# EasyEDA Pro project ELKS.eprj

# Schematic Schematic1

## Sheets
1 internal-logic: Create Date: 2023-01-13; Page Name: internal-logic; Project Name: ELKS; Schematic Name: Schematic1; Update Date: 2023-01-20; Company: EasyEDA.com; Drawed: EasyEDA Pro; Page Size: A4; Part Number: JLCPCB-002; Reviewed: EasyEDA Pro; Version: V0.1
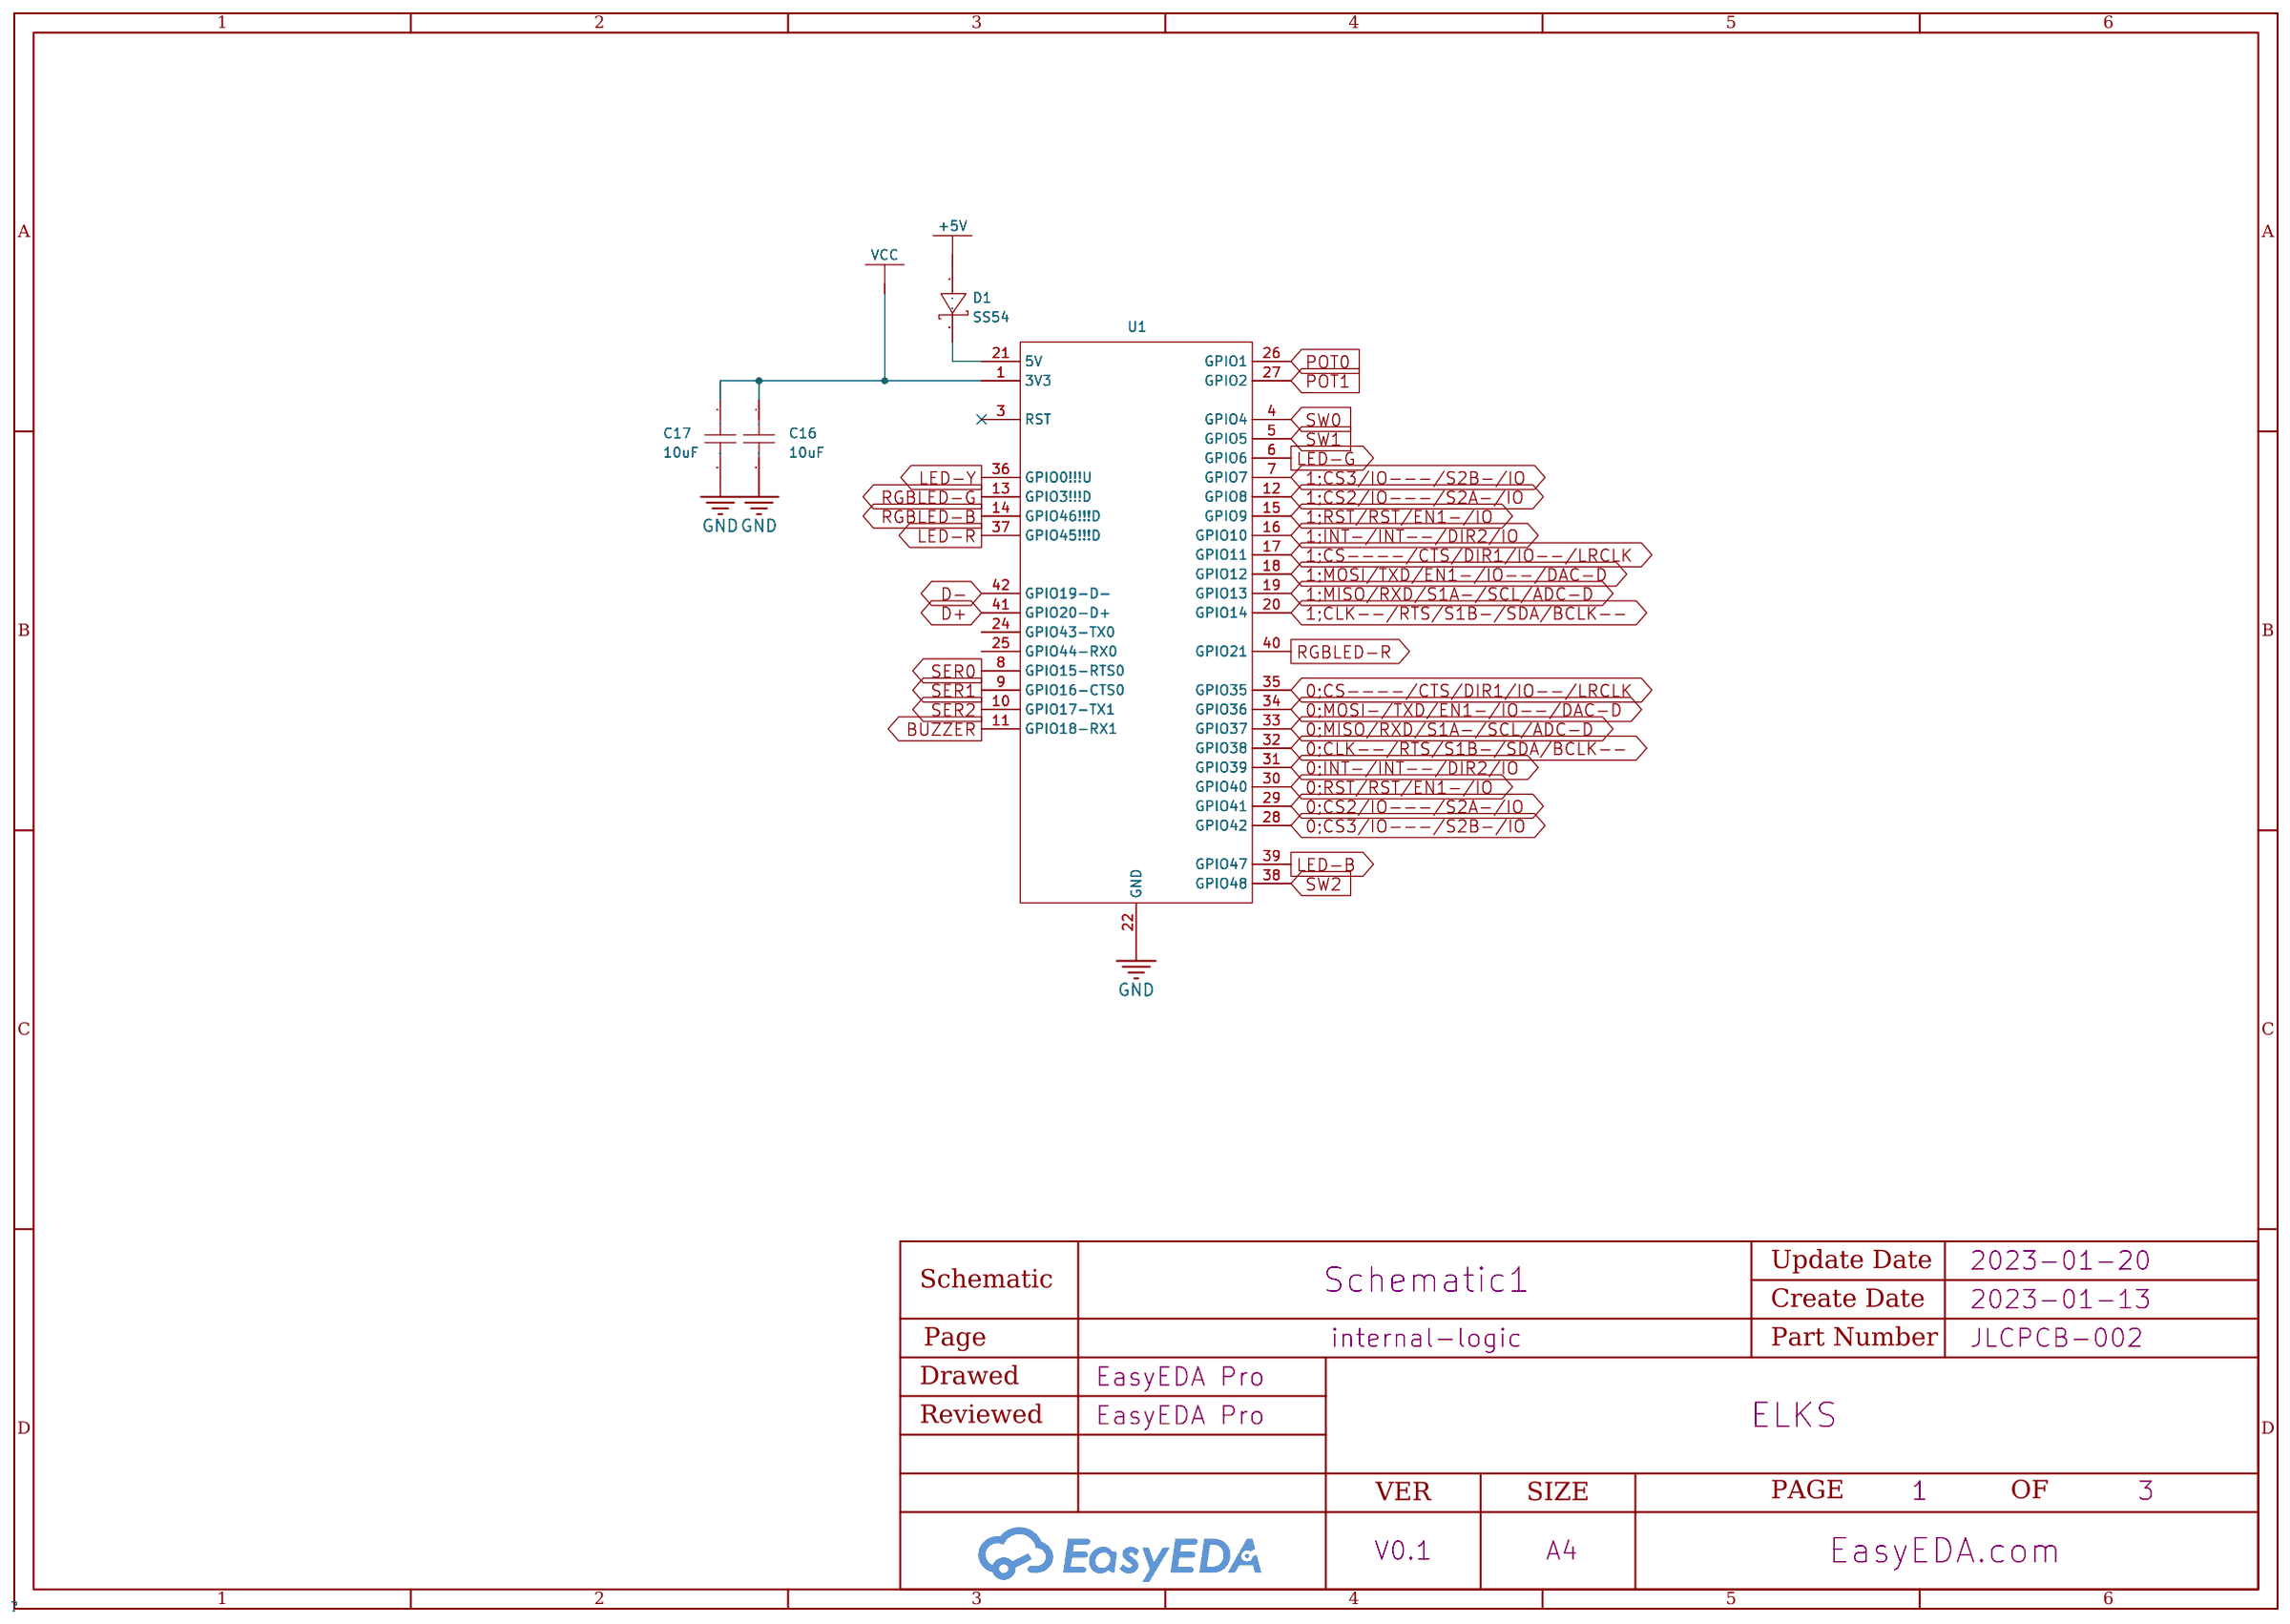
[diagram p0: internal-logic]
2 internal-peripheris: Create Date: 2023-01-14; Page Name: internal-peripheris
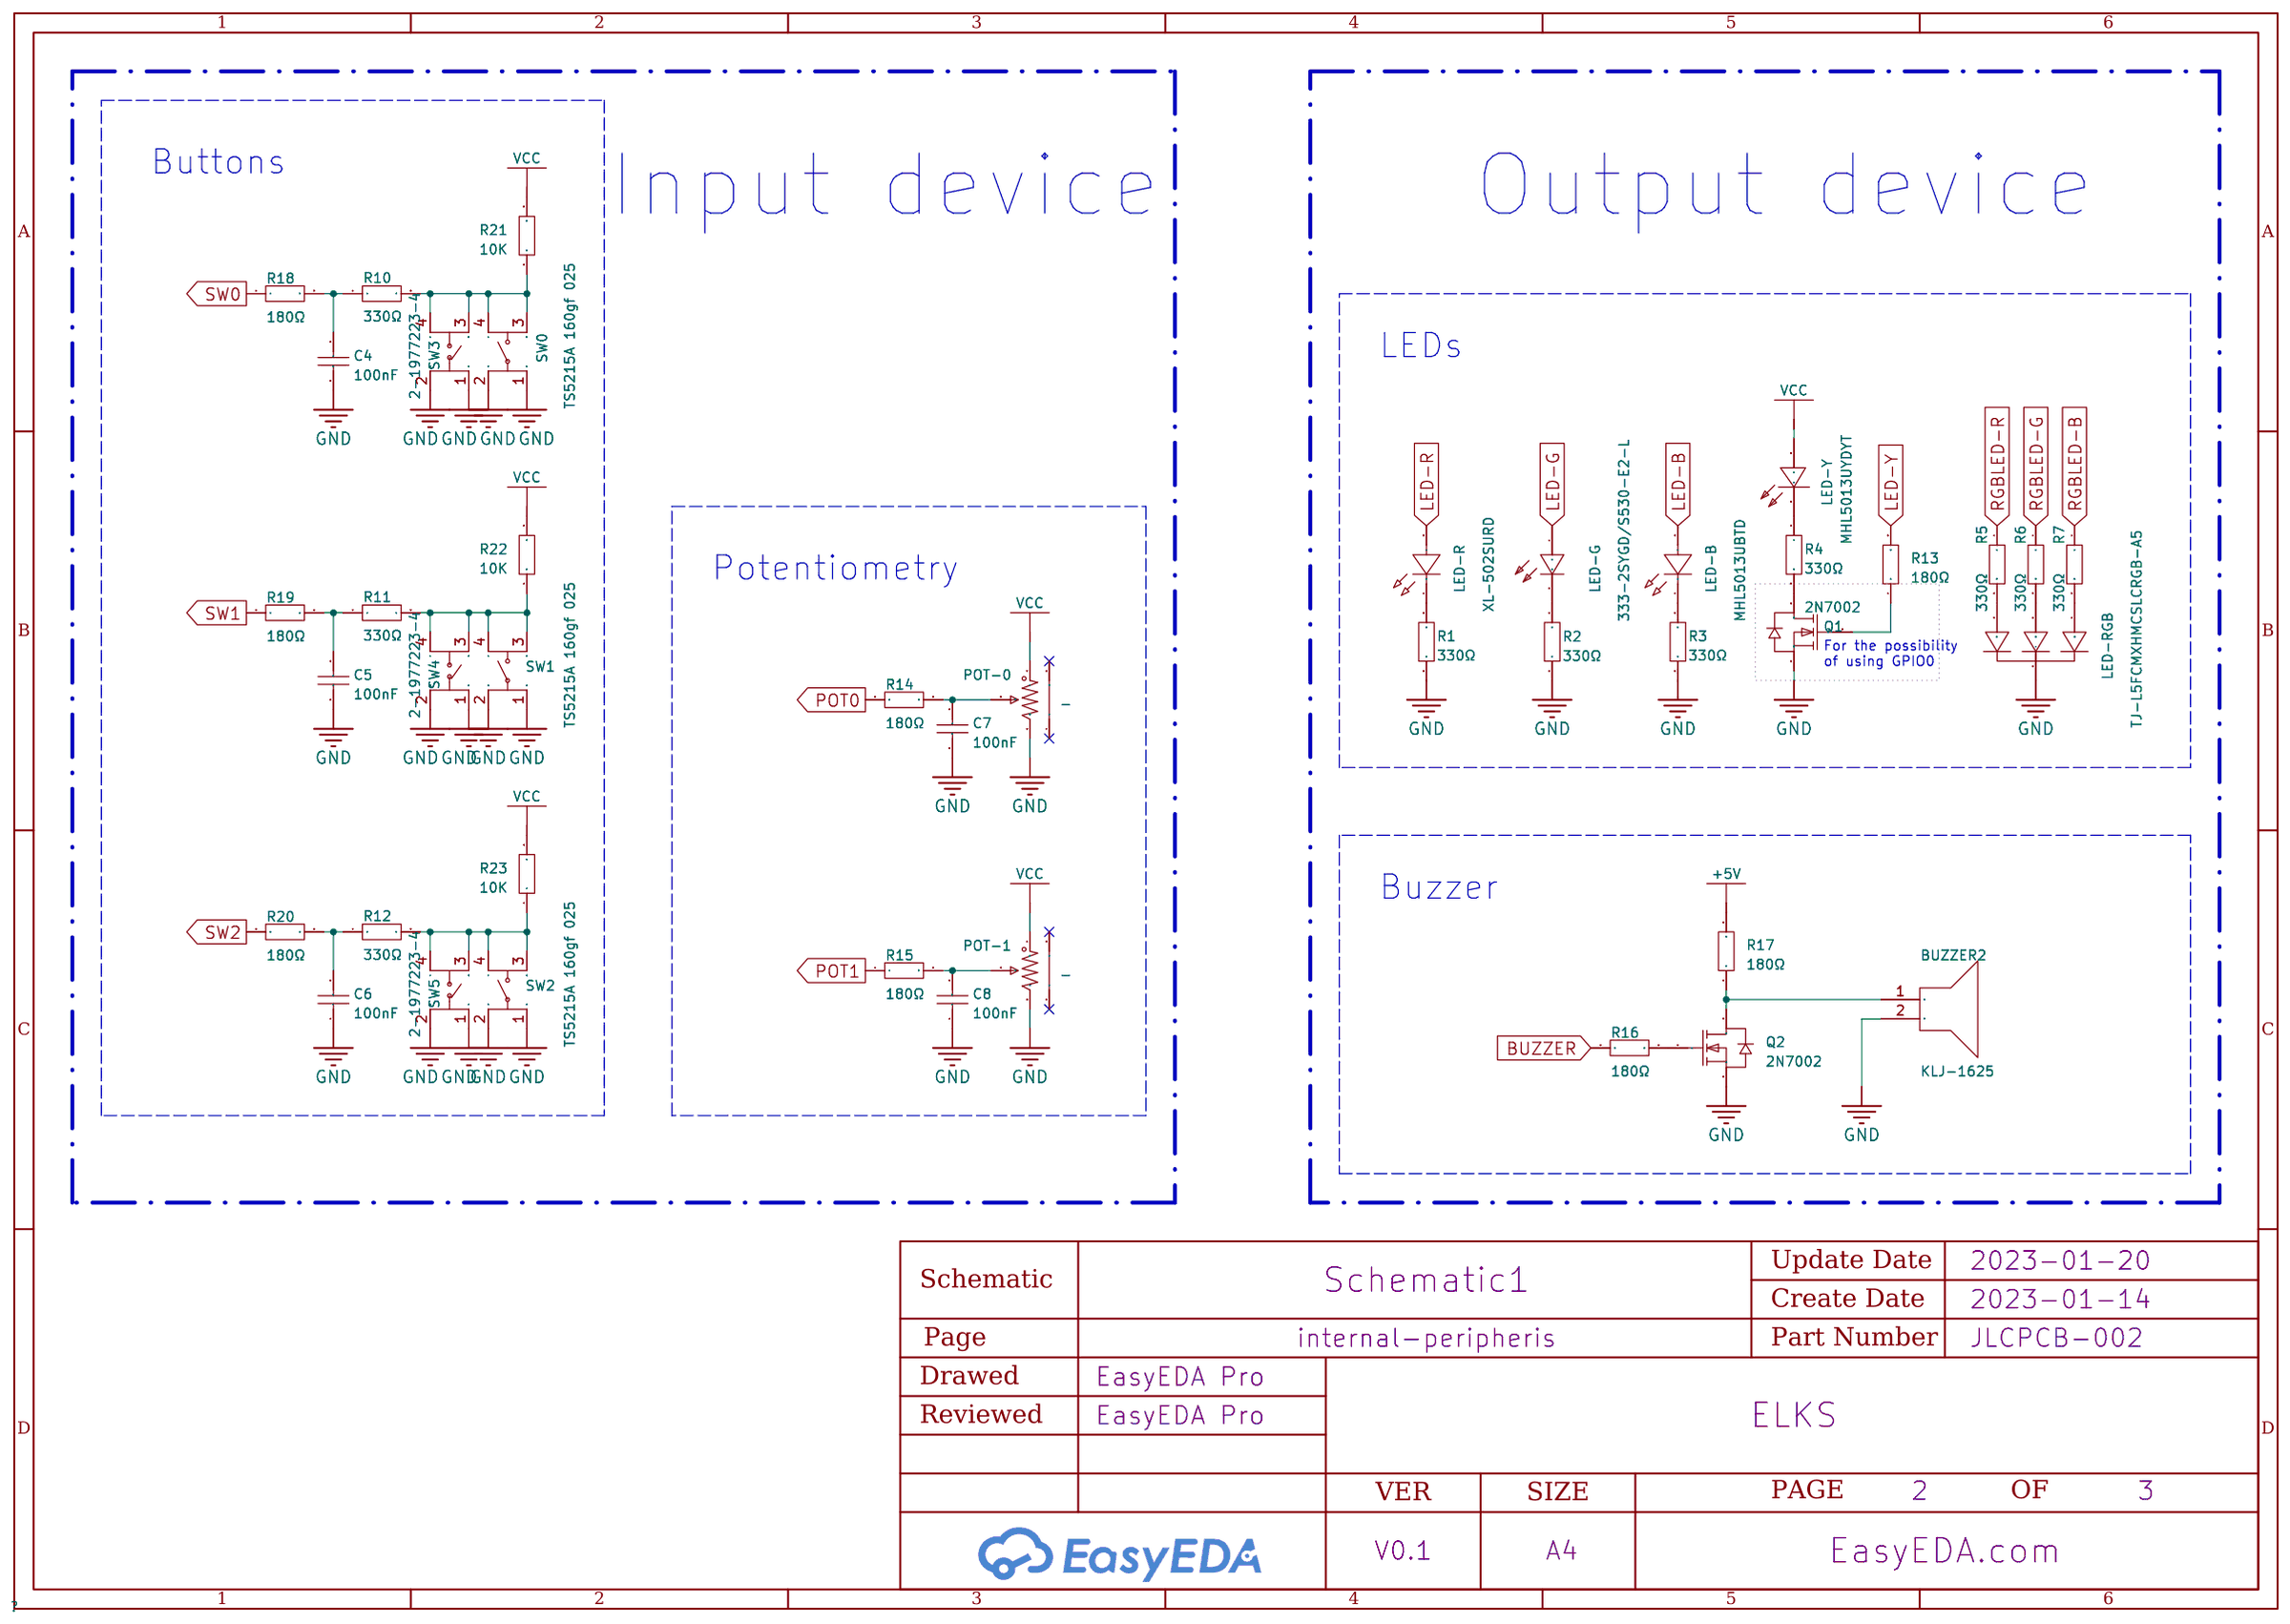
[diagram p1: internal-peripheris]
3 connectors: Create Date: 2023-01-14; Page Name: connectors
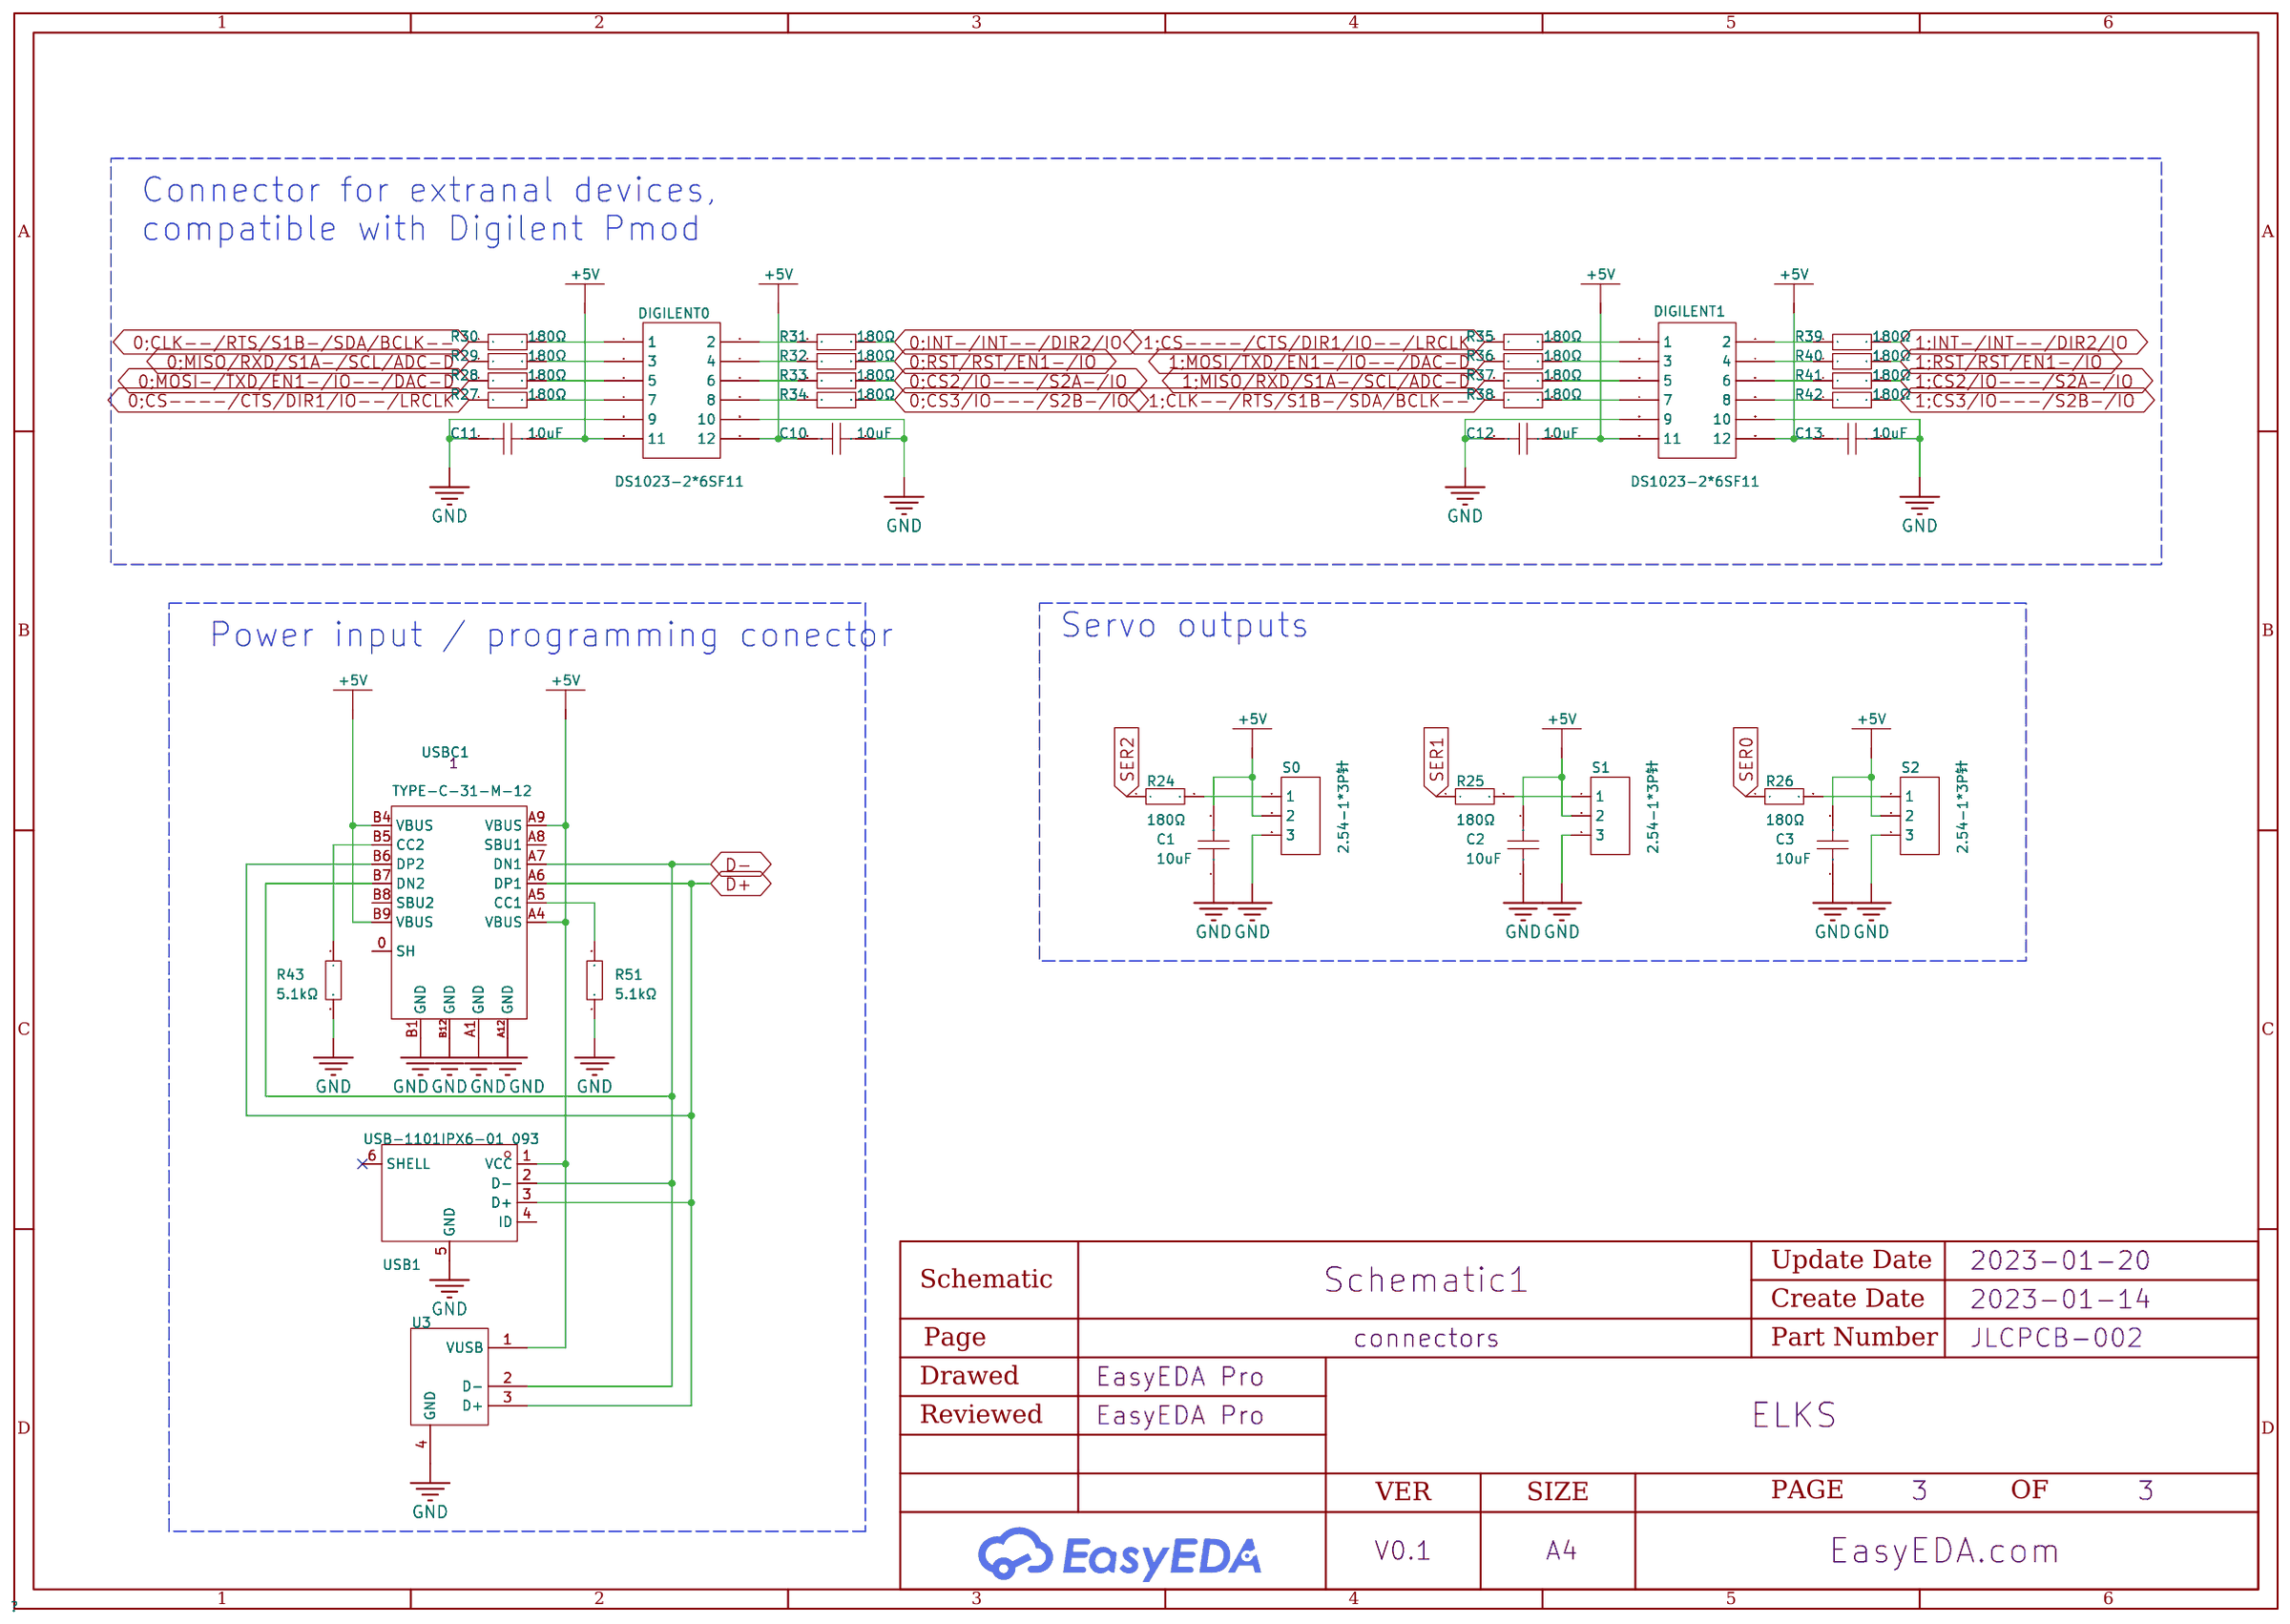
[diagram p2: connectors]

## Parts
sheet connectors
C1  10uF  [C0603]
C2  10uF  [C0603]
C3  10uF  [C0603]
C10  10uF  [C0603]
C11  10uF  [C0603]
C12  10uF  [C0603]
C13  10uF  [C0603]
DIGILENT0  DS1023-2*6SF11  [HDR-TH_12P-P2.54-V-F-R2-C6-S2.54]
DIGILENT1  DS1023-2*6SF11  [HDR-TH_12P-P2.54-V-F-R2-C6-S2.54]
R24  180Ω  [R0603]
R25  180Ω  [R0603]
R26  180Ω  [R0603]
R27  180Ω  [R0603]
R28  180Ω  [R0603]
R29  180Ω  [R0603]
R30  180Ω  [R0603]
R31  180Ω  [R0603]
R32  180Ω  [R0603]
R33  180Ω  [R0603]
R34  180Ω  [R0603]
R35  180Ω  [R0603]
R36  180Ω  [R0603]
R37  180Ω  [R0603]
R38  180Ω  [R0603]
R39  180Ω  [R0603]
R40  180Ω  [R0603]
R41  180Ω  [R0603]
R42  180Ω  [R0603]
R43  5.1kΩ  [R0603]
R51  5.1kΩ  [R0603]
S0  2.54-1*3P针  [HDR-TH_3P-P2.54-V-M-1]
S1  2.54-1*3P针  [HDR-TH_3P-P2.54-V-M-1]
S2  2.54-1*3P针  [HDR-TH_3P-P2.54-V-M-1]
U3  -  [usb-PCB]
USB1  USB-1101IPX6-01 093  [MICRO-USB-SMD_USB-1101IPX6-01-093]
USBC1  TYPE-C-31-M-12  [USB-C_SMD-TYPE-C-31-M-12]
sheet internal-logic
C16  10uF  [C0603]
C17  10uF  [C0603]
D1  SS54  [SMA_L4.4-W2.8-LS5.4-R-RD]
U1  -  [ESP32-S3-DevKitC-1]
sheet internal-peripheris
BUZZER2  KLJ-1625  [BUZ-SMD_L16.0-W16.0]
C4  100nF  [C0402_NEW]
C5  100nF  [C0402_NEW]
C6  100nF  [C0402_NEW]
C7  100nF  [C0402_NEW]
C8  100nF  [C0402_NEW]
LED-B  MHL5013UBTD  [LED-TH_BD5.0-P2.54-L-RD_BLUE]
LED-G  333-2SYGD/S530-E2-L  [LED-TH_BD5.0-P2.54-FD]
LED-R  XL-502SURD  [LED-TH_BD5.9-P2.54-RD_RED]
LED-RGB  TJ-L5FCMXHMCSLCRGB-A5  [LED-TH_4P-BD5.8-P1.30]
LED-Y  MHL5013UYDYT  [LED-TH_BD5.0-P2.54-L-RD_YELLOW]
POT-0  -  [RES-ADJ-TH_RK09D1130C4G]
POT-1  -  [RES-ADJ-TH_RK09D1130C4G]
Q1  2N7002  [SOT-23-3_L2.9-W1.3-P1.90-LS2.4-BR]
Q2  2N7002  [SOT-23-3_L2.9-W1.3-P1.90-LS2.4-BR]
R1  330Ω  [R0402]
R2  330Ω  [R0402]
R3  330Ω  [R0402]
R4  330Ω  [R0402]
R5  330Ω  [R0402]
R6  330Ω  [R0402]
R7  330Ω  [R0402]
R10  330Ω  [R0402]
R11  330Ω  [R0402]
R12  330Ω  [R0402]
R13  180Ω  [R0603]
R14  180Ω  [R0603]
R15  180Ω  [R0603]
R16  180Ω  [R0603]
R17  180Ω  [R0603]
R18  180Ω  [R0603]
R19  180Ω  [R0603]
R20  180Ω  [R0603]
R21  10K  [R0603]
R22  10K  [R0603]
R23  10K  [R0603]
SW0  TS5215A 160gf 025  [SW-SMD_4P-L5.2-W5.2-P3.70-LS6.4]
SW1  TS5215A 160gf 025  [SW-SMD_4P-L5.2-W5.2-P3.70-LS6.4]
SW2  TS5215A 160gf 025  [SW-SMD_4P-L5.2-W5.2-P3.70-LS6.4]
SW3  2-1977223-4  [SW-SMD_4P-L6.0-W6.0-P4.50-LS10.0-BL]
SW4  2-1977223-4  [SW-SMD_4P-L6.0-W6.0-P4.50-LS10.0-BL]
SW5  2-1977223-4  [SW-SMD_4P-L6.0-W6.0-P4.50-LS10.0-BL]

## Library data of the parts
C1-C3 C10-C13 C16 C17 = CL10A106MA8NRNC: Capacitance: Tolerance:±20% Tolerance:±20% Voltage Rated: Temperature Coefficient:; LCSC Part Name: 10uF ±20% 25V; Supplier Part: C96446; Manufacturer: SAMSUNG(三星); Supplier Footprint: 0603; JLCPCB Part Class: Basic Part; Datasheet: https://atta.szlcsc.com/upload/public/pdf/source/20170325/1490427913016.pdf; Supplier: LCSC; Tolerance: ±20%
DIGILENT0 DIGILENT1 = DS1023-2*6SF11: Number of Rows:双排 Number of Holes:12 Pitch:2.54mm Holes Structure:2x6P Row Spacing:2.54mm Mounting Type:Straight Insulation Height:- Contact Material:- Contact Plating:-; LCSC Part Name: 2.54mm 2x6P; Supplier Part: C92269; Manufacturer: CONNFLY; Supplier Footprint: 插件,P=2.54mm; JLCPCB Part Class: Extended Part; Datasheet: https://atta.szlcsc.com/upload/public/pdf/source/20170116/1484561256325.pdf; Supplier: LCSC; Number of Rows: 双排; Number of Holes: 12; Pitch: 2.54mm; Holes Structure: 2x6P; Row Spacing: 2.54mm; Mounting Type: Straight
R13-R20 R24-R42 = 0603WAF1800T5E: Type:Thick Film Resistors Resistance: Tolerance:±1% Tolerance:±1% Power(Watts): Temperature Coefficient:±100ppm/℃ Temperature Coefficient:±100ppm/℃ Overload Voltage (Max): Operating Temperature Range:-55℃~+155℃ Operating Temperature Range:-55℃~+155℃; LCSC Part Name: 180Ω ±1% 100mW; Supplier Part: C22828; Manufacturer: UNI-ROYAL(厚声); Supplier Footprint: 0603; JLCPCB Part Class: Basic Part; Datasheet: https://atta.szlcsc.com/upload/public/pdf/source/20200306/C422600_1E6D84923E4A46A82E41ADD87F860B5C.pdf; Supplier: LCSC; Type: Thick Film Resistors; Tolerance: ±1%; Temperature Coefficient: ±100ppm/℃; Operating Temperature Range: -55℃~+155℃
R43 R51 = RC0603FR-075K1L: Type:Thick Film Resistors Resistance: Tolerance:±1% Tolerance:±1% Power(Watts): Temperature Coefficient:±100ppm/℃ Temperature Coefficient:±100ppm/℃ Overload Voltage (Max): Operating Temperature Range:-55℃~+155℃ Operating Temperature Range:-55℃~+155℃; LCSC Part Name: 5.1kΩ ±1% 100mW; Supplier Part: C105580; Manufacturer: YAGEO(国巨); Supplier Footprint: 0603; JLCPCB Part Class: Extended Part; Datasheet: https://atta.szlcsc.com/upload/public/pdf/source/20170428/1493376741323.pdf; Supplier: LCSC; Type: Thick Film Resistors; Tolerance: ±1%; Temperature Coefficient: ±100ppm/℃; Operating Temperature Range: -55℃~+155℃
S0-S2 = 2.54-1*3P针: Number of Rows:单排 Number of Pins:3 Pitch:2.54mm Pin Structure:1x3P Row Spacing:- Mounting Type:Straight Circluar Pins/Square Pins:Square Pins Current Rating (Max):3A Voltage Rating (Max):- Length of Mating Pin:- Insulation Height:- Length of End Connectio; LCSC Part Name: 2.54mm 1x3P 直插 方针; Supplier Part: C49257; Manufacturer: BOOMELE(博穆精密); Supplier Footprint: 插件,P=2.54mm; JLCPCB Part Class: Extended Part; Datasheet: https://atta.szlcsc.com/upload/public/pdf/source/20221018/3E9408392E35E6F57A28985E5F7BF5C9.pdf; Supplier: LCSC; Number of Rows: 单排; Number of Pins: 3; Pitch: 2.54mm; Pin Structure: 1x3P; Mounting Type: Straight; Circluar Pins/Square Pins: Square Pins; Current Rating (Max): 3A; Operating Temperature Range: -40℃~+105℃; Color: Black
U3 = USB_B_Micro
USB1 = USB-1101IPX6-01 093: Connector Type:Micro-B Standard:USB 2.0 Gender:Female Number of Contacts:5 Number of Ports:1 Mounting Style:Surface Mount Current Rating - Power (Max):- Operating Temperature Range:- Operating Temperature Range:-; LCSC Part Name: Micro-B 母座 卧贴 两件套; Supplier Part: C2858268; Manufacturer: SHOU HAN(首韩); Supplier Footprint: SMD; JLCPCB Part Class: Extended Part; Datasheet: https://atta.szlcsc.com/upload/public/pdf/source/20210728/C2858268_9A7ED86426E0368ABC54B2871FA1DA00.pdf; Supplier: LCSC; Connector Type: Micro-B; Standard: USB 2.0; Gender: Female; Number of Contacts: 5; Number of Ports: 1; Mounting Style: Surface Mount; NO_CONNECT: yes
USBC1 = TYPE-C-31-M-12: Connector Type:Type-C Standard:- Gender:Female Number of Contacts:16 Number of Ports:1 Current Rating - Power (Max):250mA; Supplier Part: C165948; Manufacturer: 韩国韩荣; JLCPCB Part Class: Extended Part; Datasheet: https://atta.szlcsc.com/upload/public/pdf/source/20210111/C2682493_D8CCFED08835E878D16ACCF4460E43B8.pdf; Supplier: LCSC; Connector Type: Type-C; Gender: Female; Number of Contacts: 16; Number of Ports: 1; Current Rating - Power (Max): 250mA; NUMBER: 1
D1 = SS54_C22452: Reverse Voltage (Vr):40V Average Rectified Current (Io):5A Forward Voltage (Vf@If):550mV@5A; LCSC Part Name: 40V 5A 550mV@5A; Supplier Part: C22452; Manufacturer: MDD; Supplier Footprint: SMA(DO-214AC); JLCPCB Part Class: Basic Part; Datasheet: https://atta.szlcsc.com/upload/public/pdf/source/20190306/C22452_DC5E4F74C3B638F6D8E4C7650D5BF30E.pdf; Supplier: LCSC; Reverse Voltage (Vr): 40V; Average Rectified Current (Io): 5A; Forward Voltage (Vf@If): 550mV@5A
U1 = ESP32-S3-DevKitC-1
BUZZER2 = KLJ-1625: Oscillator Circuit:无源(外部驱动) Technology Type:压电式 Rated Voltage:3V Sound Pressure Level (SPL):75dB@3V,10cm Length:16mm Width:16mm Height:2.8mm; Supplier Part: C201041; Manufacturer: KELIKING(凯丽金); Supplier Footprint: SMD,16x16mm; JLCPCB Part Class: Extended Part; Datasheet: https://atta.szlcsc.com/upload/public/pdf/source/20221115/A71AE6D9031C4370ECC5B9F00109D1D9.pdf; Supplier: LCSC; Oscillator Circuit: 无源(外部驱动); Technology Type: 压电式; Rated Voltage: 3V; Sound Pressure Level (SPL): 75dB@3V,10cm; Length: 16mm; Width: 16mm; Height: 2.8mm
C4-C8 = CL05B104KO5NNNC: Capacitance: Tolerance:±10% Tolerance:±10% Voltage Rated: Temperature Coefficient:; LCSC Part Name: 100nF ±10% 16V; Supplier Part: C1525; Manufacturer: SAMSUNG(三星); Supplier Footprint: 0402; JLCPCB Part Class: Basic Part; Datasheet: https://atta.szlcsc.com/upload/public/pdf/source/20160103/1457707674891.pdf; Supplier: LCSC; Tolerance: ±10%
LED-B = MHL5013UBTD: Emitted Color:blue Diode Configuration:- Lens Color:Blue Diffused Dominant Wavelength:468nm Dominant Wavelength:468nm Peak Wavelength:470nm Color Temperature:- Color Temperature:- Forward Current:20mA Power Dissipation:120mW Viewing Angle:60° Mounting Syt; LCSC Part Name: 蓝灯 468nm; Supplier Part: C2764902; Manufacturer: MEIHUA(美华); Supplier Footprint: 插件,D=5mm; JLCPCB Part Class: Extended Part; Datasheet: https://atta.szlcsc.com/upload/public/pdf/source/20210406/C2764902_272F1A3B8ACD7B2D842B452C15C672BC.pdf; Supplier: LCSC; Emitted Color: blue; Lens Color: Blue Diffused; Dominant Wavelength: 468nm; Peak Wavelength: 470nm; Forward Current: 20mA; Power Dissipation: 120mW; Viewing Angle: 60°; Operating Temperature: -25℃~+85℃; Lamp Holder Type: 5mm圆形灯头
LED-G = 333-2SYGD/S530-E2-L: Emitted Color:普绿/Yellow-Green Diode Configuration:- Lens Color:Green Diffused Dominant Wavelength:573nm~573nm Dominant Wavelength:573nm~573nm Peak Wavelength:575nm Color Temperature:- Color Temperature:- Forward Current:20mA Power Dissipation:60mW Viewing; LCSC Part Name: 普绿/黄绿 573nm; Supplier Part: C99697; Manufacturer: EVERLIGHT(亿光); Supplier Footprint: 插件,D=5mm; JLCPCB Part Class: Extended Part; Datasheet: https://atta.szlcsc.com/upload/public/pdf/source/20170428/1493376834720.pdf; Supplier: LCSC; Emitted Color: 普绿/Yellow-Green; Lens Color: Green Diffused; Dominant Wavelength: 573nm~573nm; Peak Wavelength: 575nm; Forward Current: 20mA; Power Dissipation: 60mW; Viewing Angle: 45°; Operating Temperature: -40℃~+85℃; Lamp Holder Type: 5mm圆形灯头
LED-R = XL-502SURD: Emitted Color:红灯 Lens Color:Red Dominant Wavelength:- Dominant Wavelength:- Peak Wavelength:625nm Color Temperature:- Color Temperature:- Forward Current:20mA Power Dissipation:80mW Viewing Angle:50° Mounting Sytle:- Operating Temperature:-25℃~+85℃ Operat; LCSC Part Name: 红灯; Supplier Part: C2895492; Manufacturer: XINGLIGHT(成兴光); Supplier Footprint: 直插,P=2.54mm; JLCPCB Part Class: Extended Part; Datasheet: https://atta.szlcsc.com/upload/public/pdf/source/20220816/7D3B6C5DAA6D3D612C28AF3454ED9DF8.pdf; Supplier: LCSC; Emitted Color: 红灯; Lens Color: Red; Peak Wavelength: 625nm; Forward Current: 20mA; Power Dissipation: 80mW; Viewing Angle: 50°; Operating Temperature: -25℃~+85℃; Lamp Holder Type: 5mm圆形灯头
LED-RGB = TJ-L5FCMXHMCSLCRGB-A5: Emitted Color:RGB Diode Configuration:Common cathode Lens Color:White Diffused Dominant Wavelength:620nm~630nm；525nm~525nm；460nm~470nm Dominant Wavelength:620nm~630nm；525nm~525nm；460nm~470nm Peak Wavelength:520nm；620nm；465nm Color Temperature:- Color Temp; LCSC Part Name: RGB三色 共阴极 525nm 460nm~470nm 620nm~630nm 草帽; Supplier Part: C2837021; Manufacturer: TOGIALED(统佳); Supplier Footprint: 插件,D=5mm; JLCPCB Part Class: Extended Part; Datasheet: https://atta.szlcsc.com/upload/public/pdf/source/20210617/C2837021_13924A7783EE5BD0BDCCB779E5F31EA2.pdf; Supplier: LCSC; Emitted Color: RGB; Diode Configuration: Common cathode; Lens Color: White Diffused; Dominant Wavelength: 620nm~630nm；525nm~525nm；460nm~470nm; Peak Wavelength: 520nm；620nm；465nm; Forward Current: 20mA; Power Dissipation: 320mW; Operating Temperature: -20℃~+80℃; Lamp Holder Type: 5mm圆形灯头
LED-Y = MHL5013UYDYT: Emitted Color:yellow Diode Configuration:- Lens Color:Yellow Diffused Dominant Wavelength:590nm~590nm Dominant Wavelength:590nm~590nm Peak Wavelength:593nm Color Temperature:- Color Temperature:- Forward Current:20mA Power Dissipation:80mW Viewing Angle:4; LCSC Part Name: 黄灯 590nm; Supplier Part: C417348; Manufacturer: MEIHUA(美华); Supplier Footprint: 插件,D=5mm; JLCPCB Part Class: Extended Part; Datasheet: https://atta.szlcsc.com/upload/public/pdf/source/20190909/C417348_414C83853819901307593E1DF0786EBC.pdf; Supplier: LCSC; Emitted Color: yellow; Lens Color: Yellow Diffused; Dominant Wavelength: 590nm~590nm; Peak Wavelength: 593nm; Forward Current: 20mA; Power Dissipation: 80mW; Viewing Angle: 40°; Operating Temperature: -25℃~+85℃; Lamp Holder Type: 5mm圆形灯头
POT-0 POT-1 = RK09D1130C4G: Rated Voltage:- φD:- Body Length:- Temperature Coefficient:- Tolerance: Power(Watts):- Body Height:- Turns:- Body Width:- Resistance:- Temperature Coefficient:- Type:-; LCSC Part Name: 旋转电位器; Supplier Part: C470311; Manufacturer: ALPSALPINE(阿尔卑斯阿尔派); Supplier Footprint: 插件; JLCPCB Part Class: Extended Part; Datasheet: https://atta.szlcsc.com/upload/public/pdf/source/20210222/C2687325_4FFD17AAA104A4955DD1E89BBAB92083.pdf; Supplier: LCSC
Q1 Q2 = 2N7002_C8545: Type: Drain Source Voltage (Vdss): Continuous Drain Current (Id): Power Dissipation (Pd): Drain Source On Resistance (RDS(on)@Vgs,Id):7.5Ω@10V,500mA Gate Threshold Voltage (Vgs(th)@Id):2.5V@250uA; LCSC Part Name: N沟道 60V 115mA; Supplier Part: C8545; Manufacturer: CJ(江苏长电/长晶); Supplier Footprint: SOT-23; JLCPCB Part Class: Basic Part; Datasheet: https://atta.szlcsc.com/upload/public/pdf/source/20170302/1488422688078.pdf; Supplier: LCSC; Drain Source On Resistance (RDS(on)@Vgs,Id): 7.5Ω@10V,500mA; Gate Threshold Voltage (Vgs(th)@Id): 2.5V@250uA
R1-R7 R10-R12 = 0402WGF3300TCE: Resistance: Tolerance: Power(Watts): Temperature Coefficient: Temperature Coefficient: Overload Voltage (Max): Operating Temperature Range: Operating Temperature Range:; LCSC Part Name: 330Ω ±1%; Supplier Part: C25104; Manufacturer: UNI-ROYAL(厚声); Supplier Footprint: 0402; JLCPCB Part Class: Basic Part; Datasheet: https://atta.szlcsc.com/upload/public/pdf/source/20170920/C25104_1505901212369982735.pdf; Supplier: LCSC
R21-R23 = Res_0603: Supplier Footprint: 0603
SW0-SW2 = TS5215A 160gf 025: Switch Length:5.2mm Switch Width:5.2mm Switch Height:1.5mm; LCSC Part Name: 5.2x5.2x1.5 160gf 铜头; Supplier Part: C318889; Manufacturer: SHOU HAN(首韩); Supplier Footprint: SMD; JLCPCB Part Class: Extended Part; Datasheet: https://atta.szlcsc.com/upload/public/pdf/source/20220823/700F87BAC809A93C72CAD99F3E204F47.pdf; Supplier: LCSC; Switch Length: 5.2mm; Switch Width: 5.2mm; Switch Height: 1.5mm
SW3-SW5 = 2-1977223-4: LCSC Part Name: 开关; Supplier Part: C2972220; Manufacturer: TE Connectivity(美国泰科); Supplier Footprint: SMD; JLCPCB Part Class: Extended Part; Datasheet: https://atta.szlcsc.com/upload/public/pdf/source/20220726/5EE4E3149B6D9D0D3F38E950A014820C.pdf; Supplier: LCSC

## Nets
+5V: C1.2 C2.2 C3.2 C10.2 C11.1 C12.1 C13.2 D1.1(A) DIGILENT0.11 DIGILENT0.12 DIGILENT1.11 DIGILENT1.12 R17.2 S0.2 S1.2 S2.2 U3.1(VUSB) USB1.1(VCC) USBC1.A4(VBUS) USBC1.A9(VBUS) USBC1.B4(VBUS) USBC1.B9(VBUS)
GND: BUZZER2.2 C1.1 C2.1 C3.1 C4.1 C5.1 C6.1 C7.1 C8.1 C10.1 C11.2 C12.2 C13.1 C16.2 C17.2 DIGILENT0.9 DIGILENT0.10 DIGILENT1.9 DIGILENT1.10 LED-RGB.2(-) POT-0.3 POT-1.3 Q1.2(S) Q2.2(S) R1.2 R2.2 R3.2 R43.2 R51.1 S0.3 S1.3 S2.3 SW0.1 SW0.2 SW1.1 SW1.2 SW2.1 SW2.2 SW3.1 SW3.2 SW4.1 SW4.2 SW5.1 SW5.2 U1.22(GND) U3.4(GND) USB1.5(GND) USBC1.A1(GND) USBC1.A12(GND) USBC1.B1(GND) USBC1.B12(GND)
VCC: C16.1 C17.1 LED-Y.2(A) POT-0.1 POT-1.1 R21.2 R22.2 R23.2 U1.1(3V3)
0;CLK--/RTS/S1B-/SDA/BCLK--: R30.1 U1.32(GPIO38)
0;CS2/IO---/S2A-/IO: R33.2 U1.29(GPIO41)
0;CS3/IO---/S2B-/IO: R34.2 U1.28(GPIO42)
0;CS----/CTS/DIR1/IO--/LRCLK: R27.1 U1.35(GPIO35)
0;INT-/INT--/DIR2/IO: R31.2 U1.31(GPIO39)
0;MISO/RXD/S1A-/SCL/ADC-D: R29.1 U1.33(GPIO37)
0;MOSI-/TXD/EN1-/IO--/DAC-D: R28.1 U1.34(GPIO36)
0;RST/RST/EN1-/IO: R32.2 U1.30(GPIO40)
1;CLK--/RTS/S1B-/SDA/BCLK--: R38.1 U1.20(GPIO14)
1;CS2/IO---/S2A-/IO: R41.2 U1.12(GPIO8)
1;CS3/IO---/S2B-/IO: R42.2 U1.7(GPIO7)
1;CS----/CTS/DIR1/IO--/LRCLK: R35.1 U1.17(GPIO11)
1;INT-/INT--/DIR2/IO: R39.2 U1.16(GPIO10)
1;MISO/RXD/S1A-/SCL/ADC-D: R37.1 U1.19(GPIO13)
1;MOSI/TXD/EN1-/IO--/DAC-D: R36.1 U1.18(GPIO12)
1;RST/RST/EN1-/IO: R40.2 U1.15(GPIO9)
BUZZER: R16.1 U1.11(GPIO18-RX1)
D+: U1.41(GPIO20-D+) U3.3(D+) USB1.3(D+) USBC1.A6(DP1) USBC1.B6(DP2)
D-: U1.42(GPIO19-D-) U3.2(D-) USB1.2(D-) USBC1.A7(DN1) USBC1.B7(DN2)
LED-B: LED-B.2(A) U1.39(GPIO47)
LED-G: LED-G.1(A) U1.6(GPIO6)
LED-R: LED-R.2(A) U1.37(GPIO45!!!D)
LED-Y: R13.2 U1.36(GPIO0!!!U)
POT0: R14.1 U1.26(GPIO1)
POT1: R15.1 U1.27(GPIO2)
RGBLED-B: R7.1 U1.14(GPIO46!!!D)
RGBLED-G: R6.1 U1.13(GPIO3!!!D)
RGBLED-R: R5.1 U1.40(GPIO21)
SER0: R26.1 U1.8(GPIO15-RTS0)
SER1: R25.1 U1.9(GPIO16-CTS0)
SER2: R24.1 U1.10(GPIO17-TX1)
SW0: R18.1 U1.4(GPIO4)
SW1: R19.1 U1.5(GPIO5)
SW2: R20.1 U1.38(GPIO48)
$1N8518: D1.2(K) U1.21(5V)
$2N359: C7.2 POT-0.2 R14.2
$2N362: C8.2 POT-1.2 R15.2
$2N10987: C6.2 R12.1 R20.2
$2N10988: R12.2 R23.1 SW2.3 SW2.4 SW5.3 SW5.4
$2N11241: C5.2 R11.1 R19.2
$2N11242: R11.2 R22.1 SW1.3 SW1.4 SW4.3 SW4.4
$2N11304: C4.2 R10.1 R18.2
$2N11305: R10.2 R21.1 SW0.3 SW0.4 SW3.3 SW3.4
$2N12771: Q1.1(G) R13.1
$2N13946: LED-RGB.1(R) R5.2
$2N14144: LED-RGB.3(G) R6.2
$2N14210: LED-RGB.4(B) R7.2
$2N39552: LED-R.1(K) R1.1
$2N39556: LED-G.2(K) R2.1
$2N39560: LED-B.1(K) R3.1
$2N39724: LED-Y.1(K) R4.1
$2N45506: Q2.1(G) R16.2
$2N45675: BUZZER2.1 Q2.3(D) R17.1
$2N47090: Q1.3(D) R4.2
$3N11553: DIGILENT0.1 R30.2
$3N12840: DIGILENT0.2 R31.1
$3N12844: DIGILENT0.4 R32.1
$3N12848: DIGILENT0.6 R33.1
$3N12852: DIGILENT0.8 R34.1
$3N13146: DIGILENT1.5 R37.2
$3N13154: DIGILENT1.1 R35.2
$3N13372: DIGILENT1.2 R39.1
$3N13376: DIGILENT1.4 R40.1
$3N13380: DIGILENT1.6 R41.1
$3N13384: DIGILENT1.8 R42.1
$3N20834: DIGILENT0.3 R29.2
$3N20855: DIGILENT0.5 R28.2
$3N20876: DIGILENT0.7 R27.2
$3N20951: R24.2 S0.1
$3N20972: R25.2 S1.1
$3N20993: R26.2 S2.1
$3N21087: DIGILENT1.3 R36.2
$3N21108: DIGILENT1.7 R38.2
$3N35555: R43.1 USBC1.B5(CC2)
$3N35574: R51.2 USBC1.A5(CC1)

Not connected (* = marked no-connect by the designer): POT-0 4* 5*; POT-1 4* 5*; U1 3(RST)* 24(GPIO43-TX0) 25(GPIO44-RX0); USB1 4(ID) 6(SHELL)*; USBC1 0(SH) A8(SBU1) B8(SBU2)

## Notes on the sheets
sheet 2
- Buttons
- Input device
- Output device
- LEDs
- Potentiometry
- For the possibility
  of using GPIO0
- Buzzer
sheet 3
- Connector for extranal devices,
  compatible with Digilent Pmod
- Servo outputs
- Power input / programming conector

# Board PCB1
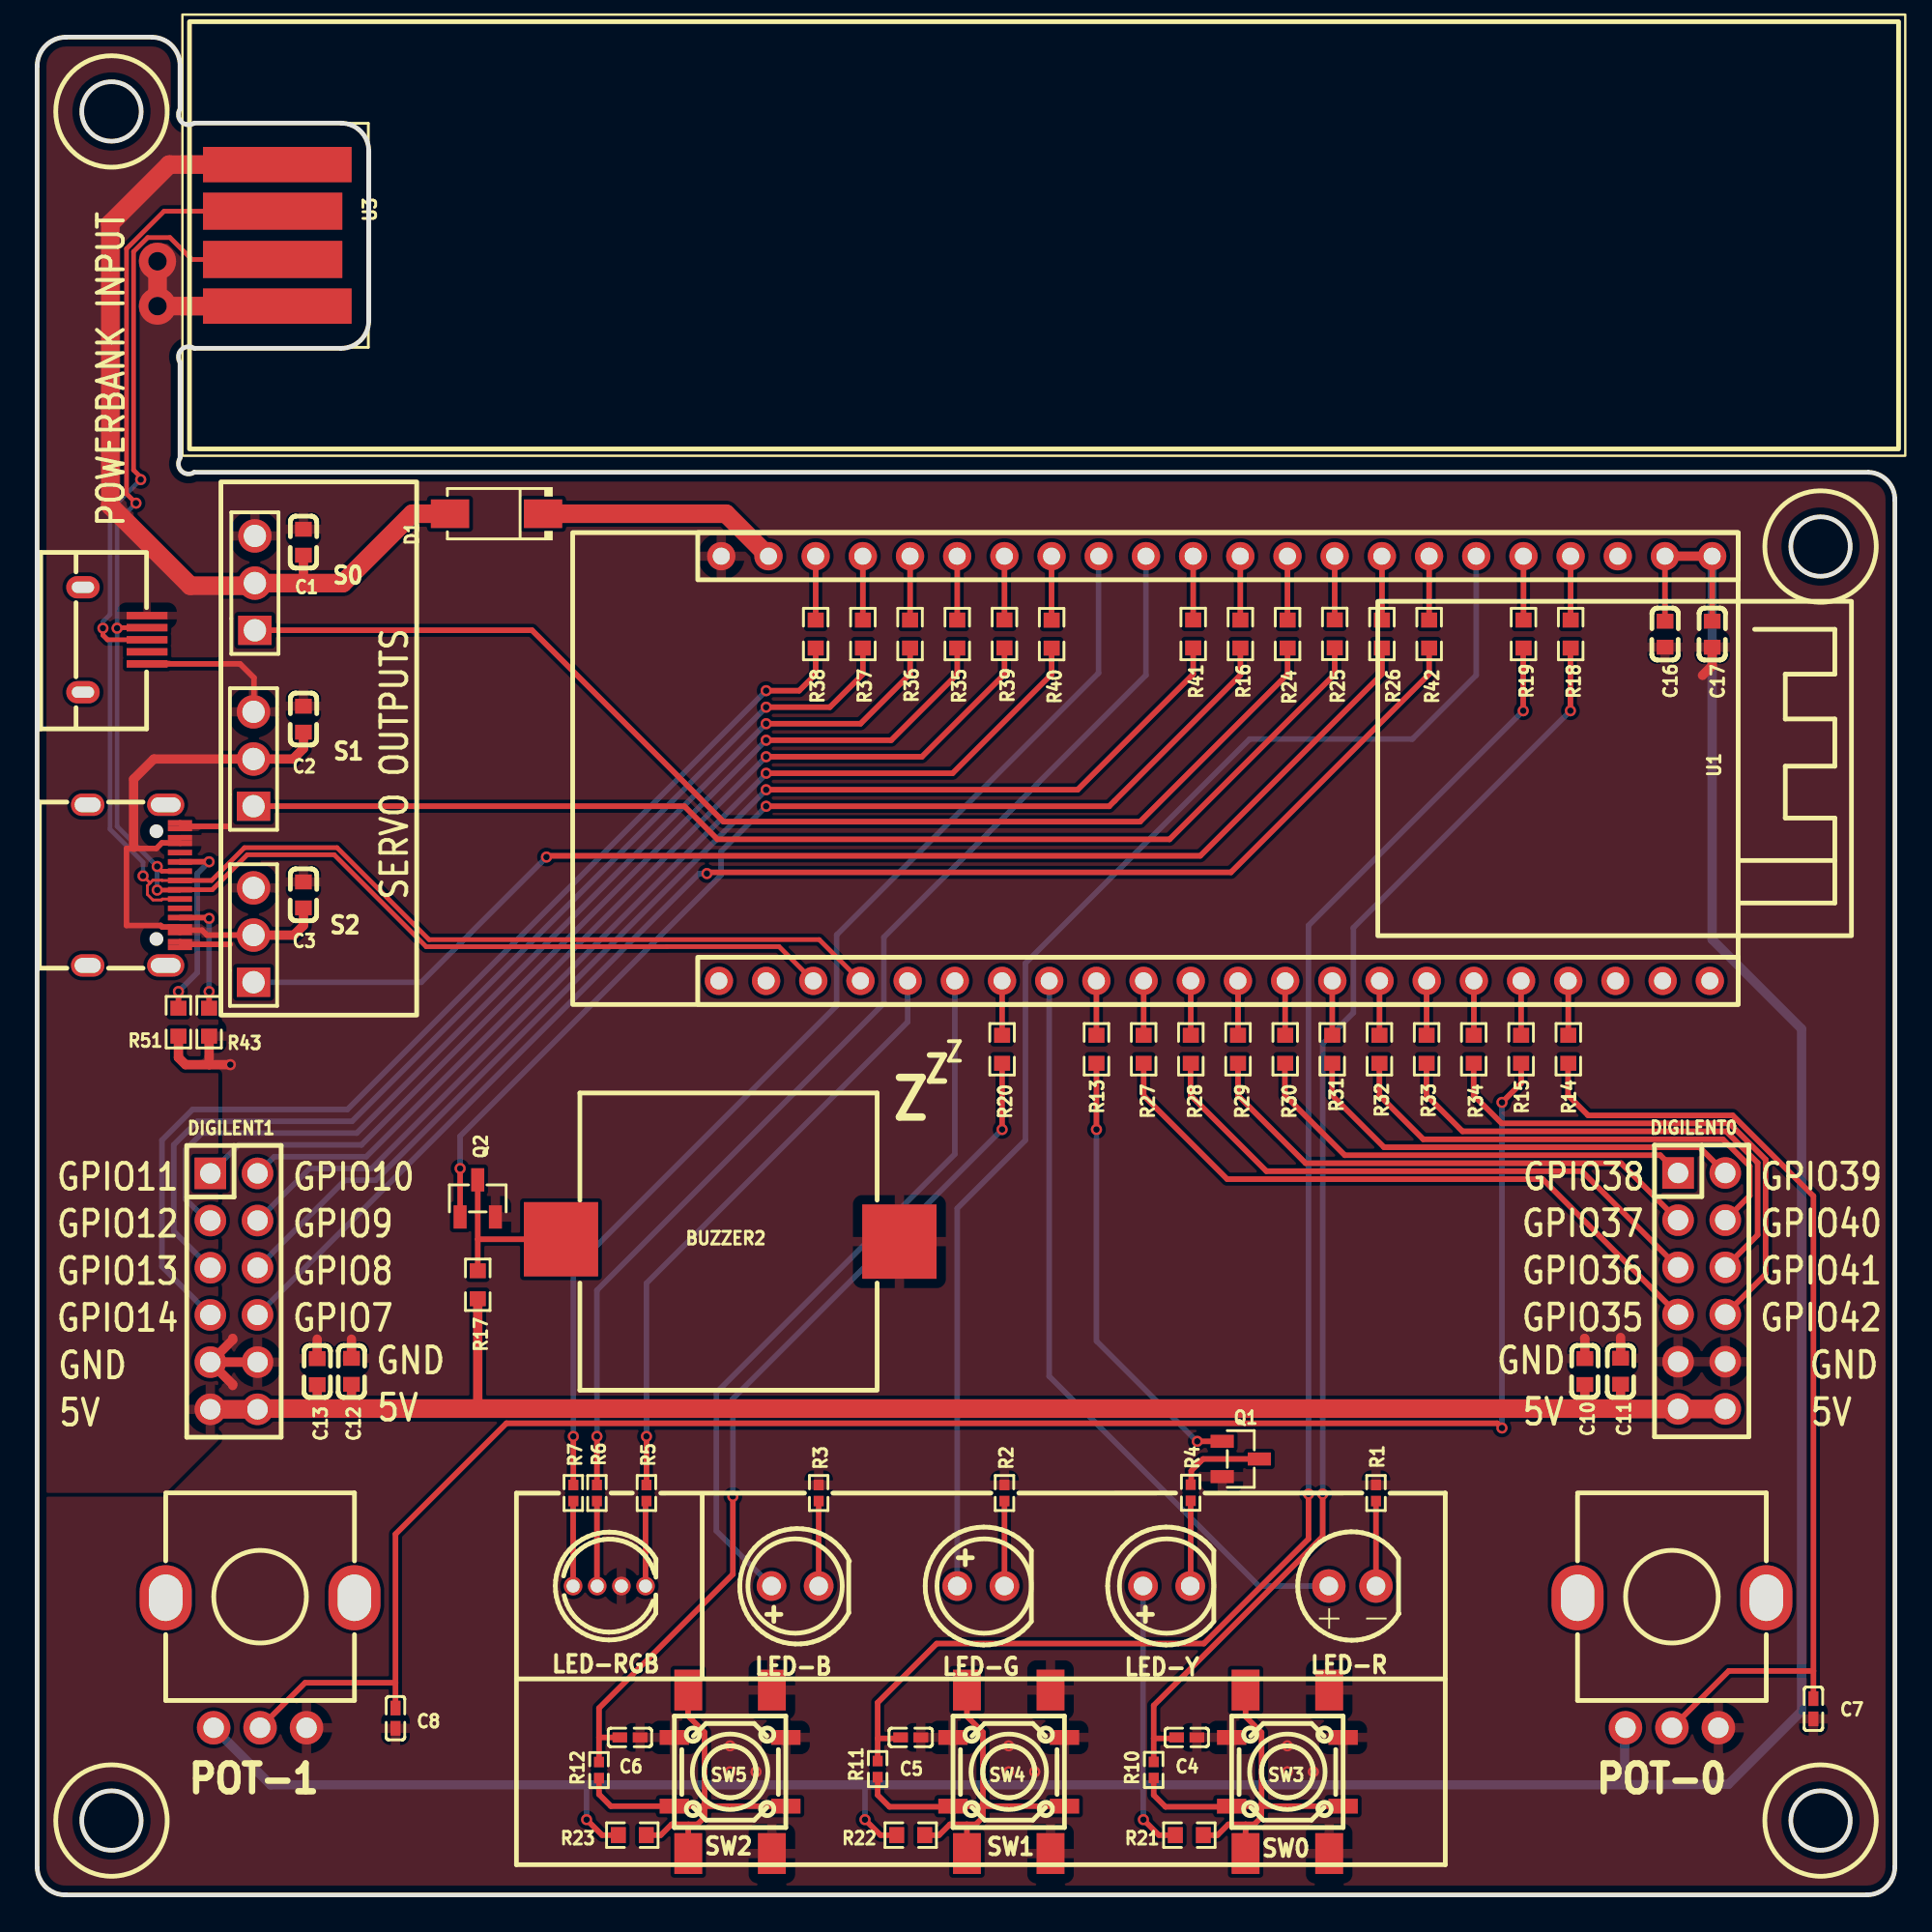
[diagram p3: board, top side]
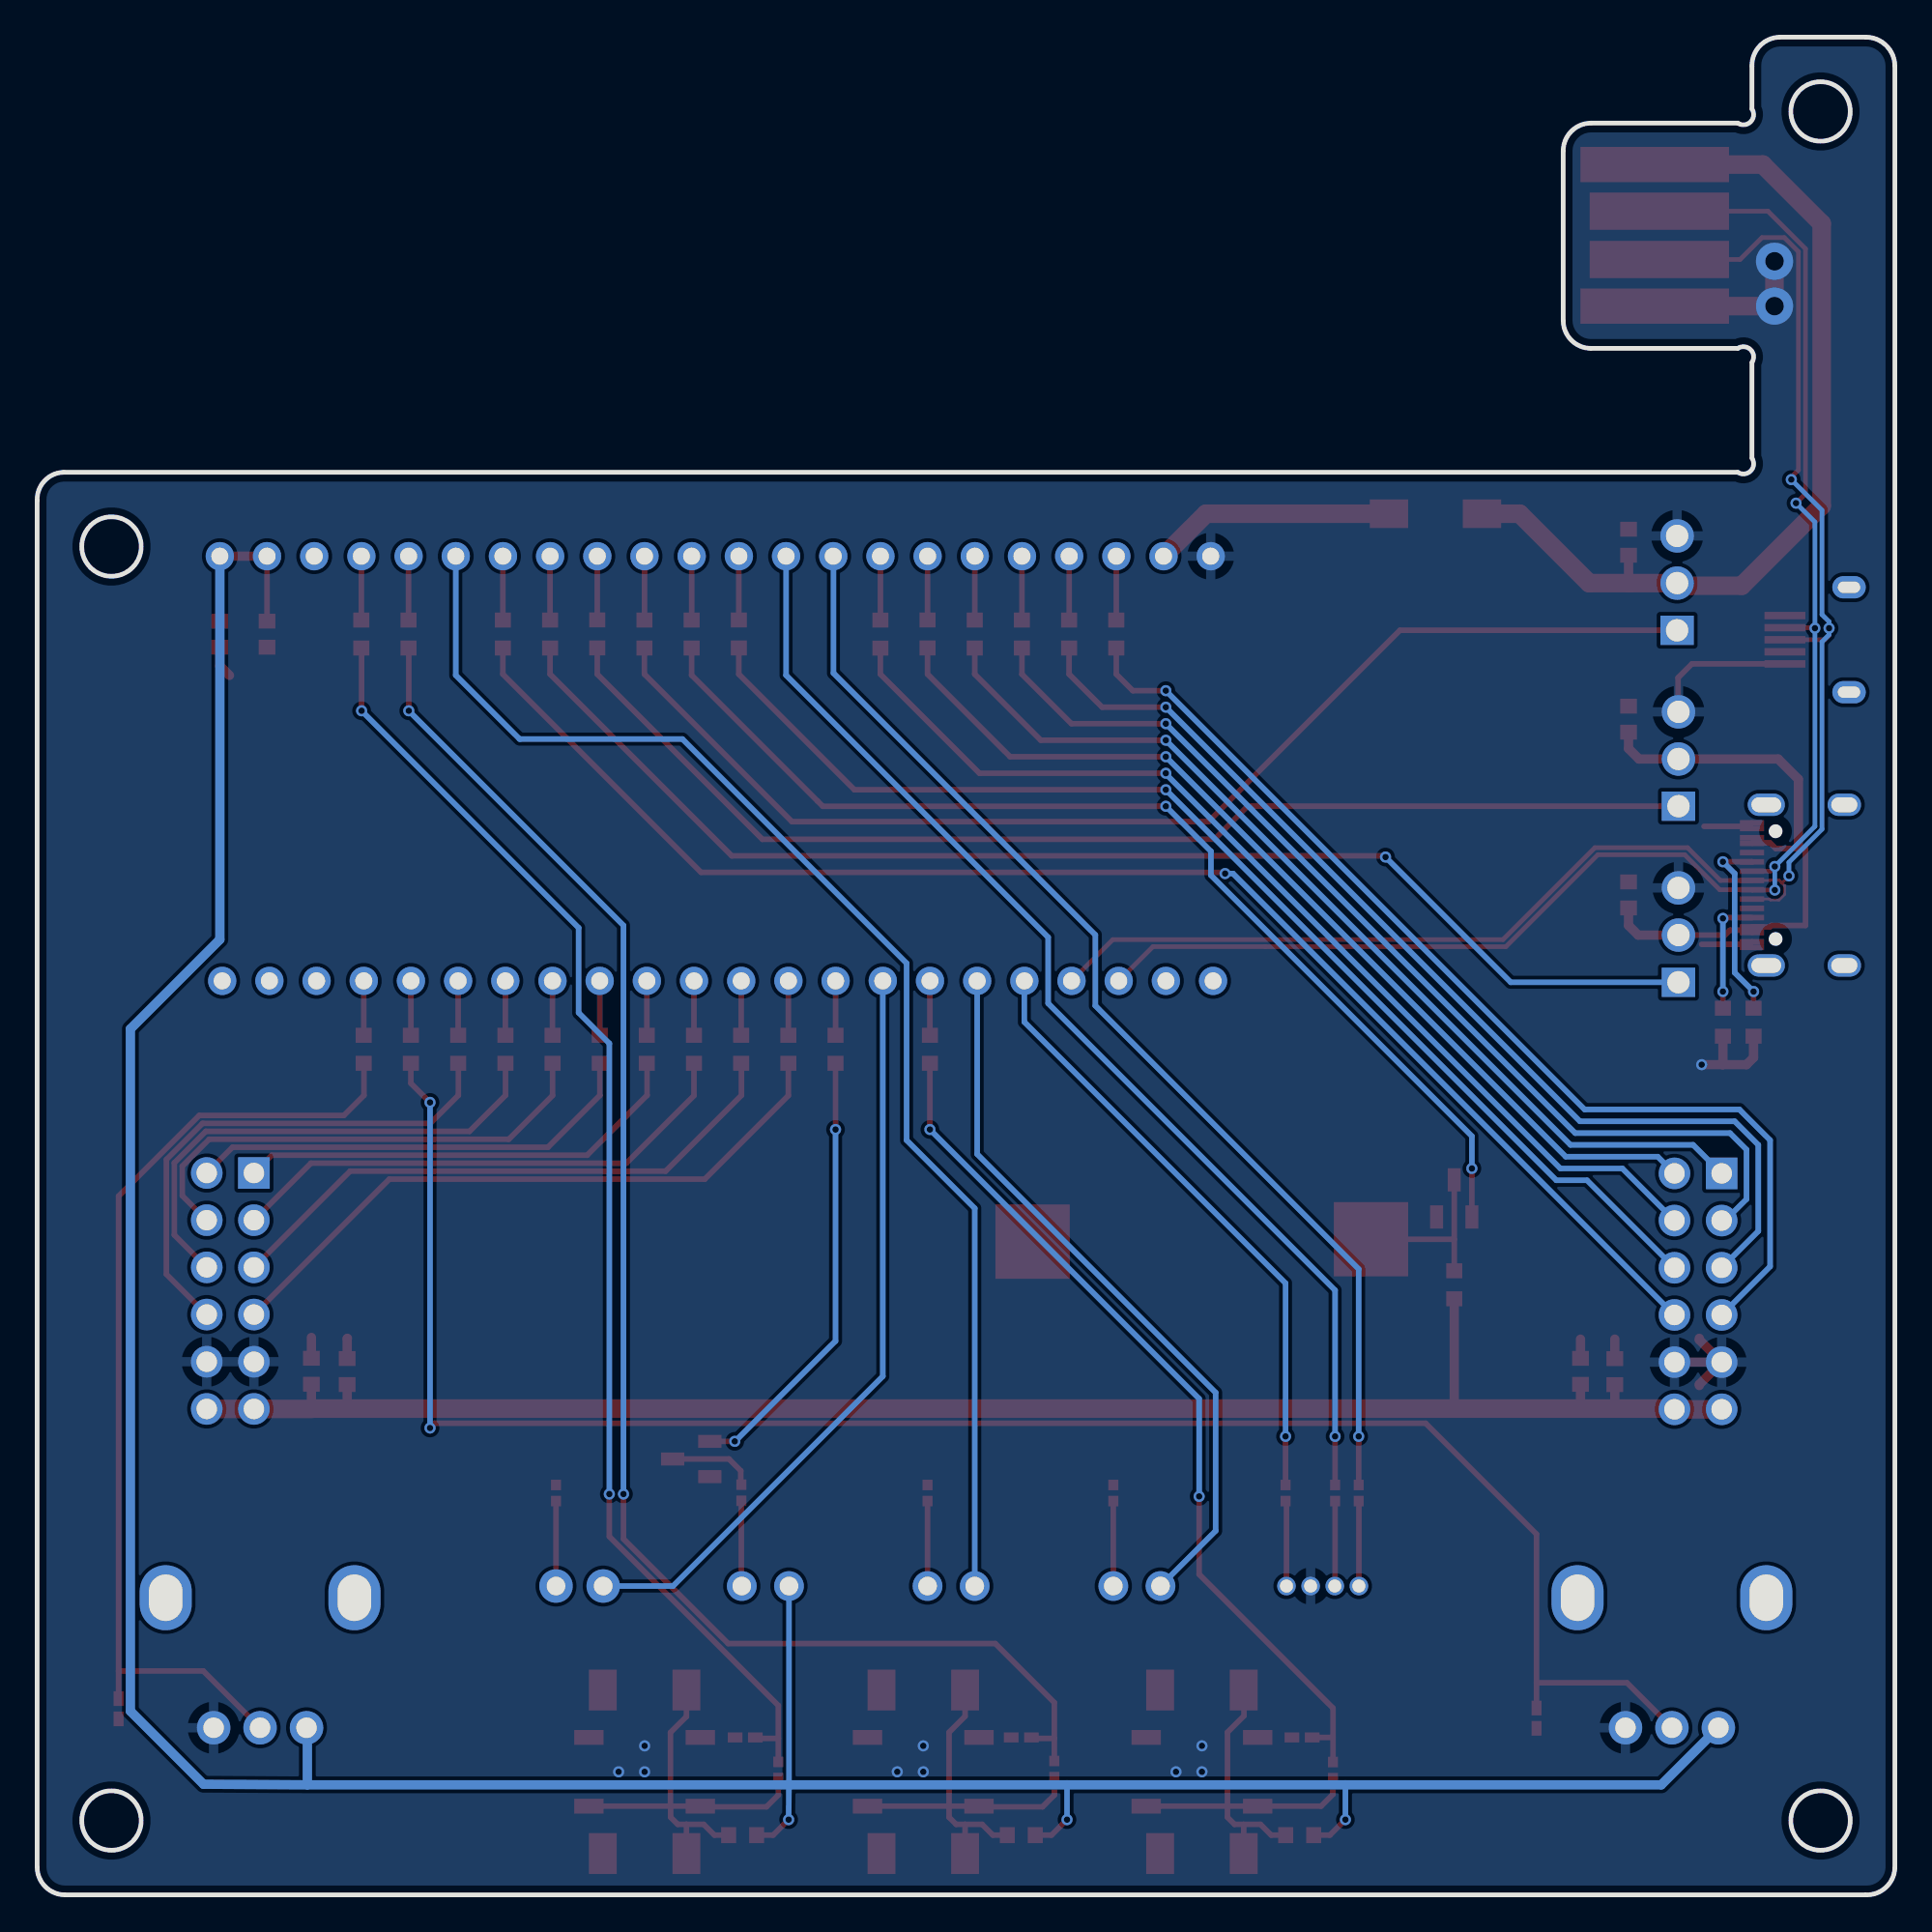
[diagram p4: board, bottom side, seen from below]

Outline 100 x 100 mm; copper layers: Top Layer, Bottom Layer. Coordinates in mm from the lower left corner of the outline.
Outline path: circle c4,96 r1.6 ; circle c4,4 r1.6 ; circle c96,72.58 r1.6 ; circle c96,4 r1.6 ; 0,98.45 arc(0.46,99.55) 1.57,100 6.19,100 arc(7.26,99.53) 7.69,98.45 7.69,96.14 arc(7.76,95.44) 8.45,95.37 16.35,95.37 arc(17.41,94.93) 17.85,93.87 17.85,84.75 arc(17.41,83.69) 16.35,83.25 8.45,83.25 arc(7.76,83.18) 7.69,82.49 7.69,77.34 arc(7.76,76.65) 8.45,76.58 98.57,76.58 arc(99.6,76.12) 100,75.08 100,1.5 arc(99.56,0.44) 98.5,0 1.57,0 arc(0.49,0.4) 0,1.45 0,98.45
Stack: Top Layer 0.035mm / Dielectric1 1.51mm FR4 er 4.5 / Bottom Layer 0.035mm

## Design rules (mm)
spacing safeClearance (default): track to track 0.128, other pairs 0.128 to 0.3
track width trackWidth (default): min 0.127, default 0.254, max 2.54
differential pair differentialPair (default): width min 0.127, default 0.254, max 2.54; gap min 0.152, default 0.152
via viaSize (default): diameter min 0.5, default 0.61, max 10; hole min 0.3, default 0.305, max 6

## Placement (name value [footprint] x y rotation side)
BUZZER2  KLJ-1625  [BUZ-SMD_L16.0-W16.0]  37.31 35.23 0 top
C1  10uF  [C0603]  14.33 72.81 270 top
C2  10uF  [C0603]  14.33 63.29 270 top
C3  10uF  [C0603]  14.33 53.83 270 top
C4  100nF  [C0402_NEW]  61.88 8.47 180 top
C5  100nF  [C0402_NEW]  47.02 8.47 180 top
C6  100nF  [C0402_NEW]  31.91 8.47 180 top
C7  100nF  [C0402_NEW]  95.62 10.02 90 top
C8  100nF  [C0402_NEW]  19.29 9.51 90 top
C10  10uF  [C0603]  83.31 28.17 270 top
C11  10uF  [C0603]  85.24 28.19 90 top
C12  10uF  [C0603]  16.92 28.18 90 top
C13  10uF  [C0603]  15.08 28.16 270 top
C16  10uF  [C0603]  87.63 67.86 270 top
C17  10uF  [C0603]  90.17 67.86 270 top
D1  SS54  [SMA_L4.4-W2.8-LS5.4-R-RD]  24.73 74.35 180 top
DIGILENT0  DS1023-2*6SF11  [HDR-TH_12P-P2.54-V-F-R2-C6-S2.54]  89.6 32.51 270 top
DIGILENT1  DS1023-2*6SF11  [HDR-TH_12P-P2.54-V-F-R2-C6-S2.54]  10.59 32.49 270 top
LED-B  MHL5013UBTD  [LED-TH_BD5.0-P2.54-L-RD_BLUE]  40.8 16.62 180 top
LED-G  333-2SYGD/S530-E2-L  [LED-TH_BD5.0-P2.54-FD]  50.8 16.62 0 top
LED-R  XL-502SURD  [LED-TH_BD5.9-P2.54-RD_RED]  70.8 16.62 180 top
LED-RGB  TJ-L5FCMXHMCSLCRGB-A5  [LED-TH_4P-BD5.8-P1.30]  30.8 16.62 0 top
LED-Y  MHL5013UYDYT  [LED-TH_BD5.0-P2.54-L-RD_YELLOW]  60.8 16.62 180 top
POT-0  -  [RES-ADJ-TH_RK09D1130C4G]  88 16.05 0 top
POT-1  -  [RES-ADJ-TH_RK09D1130C4G]  12 16.05 0 top
Q1  2N7002  [SOT-23-3_L2.9-W1.3-P1.90-LS2.4-BR]  64.79 23.46 180 top
Q2  2N7002  [SOT-23-3_L2.9-W1.3-P1.90-LS2.4-BR]  23.72 37.49 270 top
R1  330Ω  [R0402]  72.07 21.63 90 top
R2  330Ω  [R0402]  52.07 21.63 90 top
R3  330Ω  [R0402]  42.07 21.63 90 top
R4  330Ω  [R0402]  62.09 21.65 90 top
R5  330Ω  [R0402]  32.8 21.63 270 top
R6  330Ω  [R0402]  30.13 21.63 270 top
R7  330Ω  [R0402]  28.86 21.63 270 top
R10  330Ω  [R0402]  60.11 6.72 270 top
R11  330Ω  [R0402]  45.24 6.77 270 top
R12  330Ω  [R0402]  30.24 6.72 270 top
R13  180Ω  [R0603]  57.02 45.52 90 top
R14  180Ω  [R0603]  82.42 45.52 270 top
R15  180Ω  [R0603]  79.88 45.52 270 top
R16  180Ω  [R0603]  64.77 67.87 270 top
R17  180Ω  [R0603]  23.72 32.84 270 top
R18  180Ω  [R0603]  82.55 67.87 270 top
R19  180Ω  [R0603]  80.01 67.87 270 top
R20  180Ω  [R0603]  51.94 45.52 270 top
R21  10K  [R0603]  62.02 3.21 180 top
R22  10K  [R0603]  47.02 3.21 180 top
R23  10K  [R0603]  32.04 3.21 180 top
R24  180Ω  [R0603]  67.31 67.87 270 top
R25  180Ω  [R0603]  69.85 67.88 270 top
R26  180Ω  [R0603]  72.39 67.87 270 top
R27  180Ω  [R0603]  59.56 45.52 270 top
R28  180Ω  [R0603]  62.1 45.52 270 top
R29  180Ω  [R0603]  64.64 45.52 270 top
R30  180Ω  [R0603]  67.18 45.52 270 top
R31  180Ω  [R0603]  69.71 45.52 90 top
R32  180Ω  [R0603]  72.25 45.52 90 top
R33  180Ω  [R0603]  74.79 45.52 90 top
R34  180Ω  [R0603]  77.33 45.52 90 top
R35  180Ω  [R0603]  49.53 67.87 270 top
R36  180Ω  [R0603]  46.99 67.87 270 top
R37  180Ω  [R0603]  44.45 67.87 270 top
R38  180Ω  [R0603]  41.91 67.87 270 top
R39  180Ω  [R0603]  52.07 67.87 90 top
R40  180Ω  [R0603]  54.61 67.86 90 top
R41  180Ω  [R0603]  62.23 67.87 90 top
R42  180Ω  [R0603]  74.93 67.87 90 top
R43  5.1kΩ  [R0603]  9.26 46.98 270 top
R51  5.1kΩ  [R0603]  7.61 46.98 90 top
S0  2.54-1*3P针  [HDR-TH_3P-P2.54-V-M-1]  11.72 70.61 90 top
S1  2.54-1*3P针  [HDR-TH_3P-P2.54-V-M-1]  11.65 61.14 90 top
S2  2.54-1*3P针  [HDR-TH_3P-P2.54-V-M-1]  11.65 51.66 90 top
SW0  TS5215A 160gf 025  [SW-SMD_4P-L5.2-W5.2-P3.70-LS6.4]  67.3 6.62 0 top
SW1  TS5215A 160gf 025  [SW-SMD_4P-L5.2-W5.2-P3.70-LS6.4]  52.3 6.62 0 top
SW2  TS5215A 160gf 025  [SW-SMD_4P-L5.2-W5.2-P3.70-LS6.4]  37.3 6.62 0 top
SW3  2-1977223-4  [SW-SMD_4P-L6.0-W6.0-P4.50-LS10.0-BL]  67.3 6.62 90 top
SW4  2-1977223-4  [SW-SMD_4P-L6.0-W6.0-P4.50-LS10.0-BL]  52.3 6.62 90 top
SW5  2-1977223-4  [SW-SMD_4P-L6.0-W6.0-P4.50-LS10.0-BL]  37.3 6.62 90 top
U1  -  [ESP32-S3-DevKitC-1]  90.17 60.63 270 top
U3  -  [usb-PCB]  17.83 89.33 90 top
USB1  USB-1101IPX6-01 093  [MICRO-USB-SMD_USB-1101IPX6-01-093]  4.19 67.56 270 top
USBC1  TYPE-C-31-M-12  [USB-C_SMD-TYPE-C-31-M-12]  5.2 54.35 270 top

## Footprints (pads in the part's own frame, mm; a bottom-side part is the same pattern mirrored in y, then rotated)
BUZ-SMD_L16.0-W16.0
  rect 4x4 smd: 1(-9.108,0.064) 2(9.108,-0.064)
C0402_NEW
  rect 0.79x0.54 smd: 1(-0.545,0) 2(0.545,0)
C0603
  rect 0.8x0.9 smd: 1(-0.7,0) 2(0.7,0)
ESP32-S3-DevKitC-1
  round 1.524 hole 0.914: 1(-11.43,0) 1(-11.43,-2.54) 3(-11.43,-5.08) 4(-11.43,-7.62) 5(-11.43,-10.16) 6(-11.43,-12.7) 7(-11.43,-15.24) 8(-11.43,-17.78) 9(-11.43,-20.32) 10(-11.43,-22.86) 11(-11.43,-25.4) 12(-11.43,-27.94) 13(-11.43,-30.48) 14(-11.43,-33.02) 15(-11.43,-35.56) 16(-11.43,-38.1) 17(-11.43,-40.64) 18(-11.43,-43.18) 19(-11.43,-45.72) 20(-11.43,-48.26) 21(-11.43,-50.8) 22(-11.43,-53.34) 22(11.43,-0.127) 22(11.43,-50.927) 22(11.43,-53.467) 24(11.43,-2.667) 25(11.43,-5.207) 26(11.43,-7.747) 27(11.43,-10.287) 28(11.43,-12.827) 29(11.43,-15.367) 30(11.43,-17.907) 31(11.43,-20.447) 32(11.43,-22.987) 33(11.43,-25.527) 34(11.43,-28.067) 35(11.43,-30.607) 36(11.43,-33.147) 37(11.43,-35.687) 38(11.43,-38.227) 39(11.43,-40.767) 40(11.43,-43.307) 41(11.43,-45.847) 42(11.43,-48.387)
HDR-TH_3P-P2.54-V-M-1
  rect 1.575x1.8 hole 1.2: 1(-2.54,0)
  round 1.8 hole 1.2: 2(0,0) 3(2.54,0)
HDR-TH_12P-P2.54-V-F-R2-C6-S2.54
  rect 1.7x1.7 hole 1.1: 1(-6.35,-1.27)
  round 1.7 hole 1.1: 2(-6.35,1.27) 3(-3.81,-1.27) 4(-3.81,1.27) 5(-1.27,-1.27) 6(-1.27,1.27) 7(1.27,-1.27) 8(1.27,1.27) 9(3.81,-1.27) 10(3.81,1.27) 11(6.35,-1.27) 12(6.35,1.27)
LED-TH_4P-BD5.8-P1.30
  round 1 hole 0.7: 1(1.95,0) 2(0.65,0) 3(-0.65,0) 4(-1.95,0)
LED-TH_BD5.0-P2.54-FD
  round 1.6 hole 1: 1(-1.27,0) 2(1.27,0)
LED-TH_BD5.0-P2.54-L-RD_BLUE
  round 1.6 hole 1: 1(-1.27,0) 2(1.27,0)
LED-TH_BD5.0-P2.54-L-RD_YELLOW
  round 1.6 hole 1: 1(-1.27,0) 2(1.27,0)
LED-TH_BD5.9-P2.54-RD_RED
  round 1.8 hole 1: 1(-1.27,0) 2(1.27,0)
MICRO-USB-SMD_USB-1101IPX6-01-093
  rect 0.4x2.2 smd: 1(-1.3,1.725) 2(-0.65,1.725) 3(0,1.725) 4(0.65,1.725) 5(1.3,1.725)
  oval 1.2x1.8 hole 0.61x1.2: 6(-2.825,-1.725) 6(2.825,-1.725)
R0402
  rect 0.566x0.54 smd: 1(-0.433,0) 2(0.433,0)
R0603
  rect 0.806x0.864 smd: 1(-0.753,0) 2(0.753,0)
RES-ADJ-TH_RK09D1130C4G
  round 1.8 hole 1.1: 1(-2.5,-7.056) 2(0,-7.056) 3(2.5,-7.056)
  oval 2.8x3.5 hole 1.8x2.5: 4(-5.08,-0.056) 5(5.08,-0.056)
SMA_L4.4-W2.8-LS5.4-R-RD
  rect 2.062x1.539 smd: 1(2.503,0) 2(-2.503,0)
SOT-23-3_L2.9-W1.3-P1.90-LS2.4-BR
  rect 1.25x0.7 smd: 1(1,-0.95) 2(1,0.95) 3(-1,0)
SW-SMD_4P-L5.2-W5.2-P3.70-LS6.4
  rect 1.58x0.8 smd: 1(-3,1.85) 2(3,1.85) 3(-3,-1.85) 4(3,-1.85)
SW-SMD_4P-L6.0-W6.0-P4.50-LS10.0-BL
  rect 2.2x1.5 smd: 1(-4.4,-2.25) 2(4.4,-2.25) 3(-4.4,2.25) 4(4.4,2.25)
USB-C_SMD-TYPE-C-31-M-12
  oval 1.2x2 hole 0.8x1.6: 0(-4.325,1.716) 0(4.325,1.716)
  oval 1.2x1.8 hole 0.8x1.4: 0(-4.325,-2.484) 0(4.325,-2.484)
  rect 0.3x1.3 smd: A1(-3.35,2.484) A4(-2.55,2.484) A5(-1.25,2.484) A6(-0.25,2.484) A7(0.25,2.484) A8(1.25,2.484) A9(2.55,2.484) A12(3.35,2.484) B1(3.05,2.484) B4(2.25,2.484) B5(1.75,2.484) B6(0.75,2.484) B7(-0.75,2.484) B8(-1.75,2.484) B9(-2.25,2.484) B12(-3.05,2.484)
usb-PCB
  rect 1.9x8 smd: 1(3.81,4.9) 4(-3.81,4.9)
  rect 2x7.5 smd: 2(1.3,5.15) 3(-1.3,5.15)

## Nets
As in the schematic.

Pads without a net: POT-0 4 5; POT-1 4 5; U1 3 24 25; USB1 4 6; USBC1 0 A8 B8

## Via types
v1: diameter 0.6, hole 0.35, Top Layer to Bottom Layer, 48 vias
v2: diameter 2, hole 1, Top Layer to Bottom Layer, 2 vias

## Routing (per net, layer and track width the routed paths; a pad name or vN(x,y) marks a point on that pad's centre or on a via; arc(x,y) is an arc through that point)
+5V: length 173.9
  Top Layer w0.3: 7.69,52.1 6.73,52.1 6.65,52.18 4.81,52.18 4.81,56.33 6.42,56.33 6.72,56.63 7.67,56.63 7.69,56.6 ; 7.69,51.8 7.81,51.93 8.88,51.93 9.14,51.66 S2.2
  Top Layer w0.5: C13.2 15.08,26.15 ; S2.2 13.82,51.66 14.34,52.18 14.34,53.19 14.33,53.19 ; C10.2 83.31,26.19 83.33,26.18 ; 5.19,56.39 5.19,60.06 6.28,61.14 S1.2 13.77,61.14 14.34,61.71 14.34,62.58 C2.2 ; 85.26,26.16 85.24,26.18 85.24,27.49 ; C12.1 16.92,26.26 16.83,26.18 ; 23.72,26.15 R17.2 ; 14.3,70.61 14.33,70.64 14.33,72.11
  Top Layer w1: D1.1 20.19,74.35 16.46,70.61 S0.2 11.58,70.47 8.24,70.47 3.94,74.77 3.94,89.97 7.11,93.14 U3.1 ; 90.86,26.16 DIGILENT0.11 85.26,26.16 ; DIGILENT1.11 DIGILENT1.12 11.9,26.18 85.24,26.18
GND: length 39.9
  Top Layer w0.3: USB1.5 10.92,66.26 11.67,65.52 11.67,63.7 S1.3 ; 10.27,57.52 7.88,57.52 7.69,57.7 ; 10.4,51.17 7.83,51.17 7.69,51.3
  Top Layer w0.5: DIGILENT1.9 10.53,27.47 10.53,27.42 ; DIGILENT1.9 DIGILENT1.10 ; DIGILENT1.9 10.53,29.88 10.53,29.96 ; C17.2 90.17,66.16 89.65,65.64 ; R51.1 7.61,45.07 7.99,44.69 9.27,44.69 ; 9.27,44.69 v1(10.4,44.69) ; 9.27,44.69 9.26,44.7 R43.2 ; C10.1 83.31,29.94 83.3,29.96 ; C13.1 15.08,29.91 ; 16.92,28.88 16.92,29.91 ; 85.24,28.89 85.24,30.01
  Top Layer w1: U3.4 v2(6.48,85.52) v2(6.48,87.94)
  vias: v1(37.3,8.02) v1(37.3,6.62) v1(38.7,6.62) v1(52.3,8.02) v1(52.3,6.62) v1(53.7,6.62) v1(67.3,8.02) v1(67.3,6.62) v1(68.7,6.62)
VCC: length 187.7
  Top Layer w0.3: R22.2 45.4,3.21 v1(44.56,4.05) ; 90.17,72.06 C17.1 ; v1(29.58,4.05) 30.41,3.21 R23.2 ; 87.63,72.06 87.63,68.56 ; v1(59.55,4.05) 60.38,3.21 R21.2
  Top Layer w0.5: 87.63,72.06 90.17,72.06
  Bottom Layer w0.3: v1(59.55,4.05) 59.53,5.92 LED-Y.2 ; 44.56,5.92 v1(44.56,4.05) ; 29.58,5.92 v1(29.58,4.05)
  Bottom Layer w0.5: 85.46,5.92 85.46,8.95 POT-0.1 ; 85.46,5.92 12.57,5.92 POT-1.1 ; 85.46,5.92 91.04,5.95 94.98,9.89 94.98,46.61 90.17,51.43 90.17,72.06
0;CLK--/RTS/S1B-/SDA/BCLK--: length 2.9
  Top Layer w0.3: R30.1 67.18,46.27 U1.32
0;CS2/IO---/S2A-/IO: length 3
  Top Layer w0.3: 74.79,46.21 74.79,49.2 U1.29
0;CS3/IO---/S2B-/IO: length 3
  Top Layer w0.3: 77.33,46.21 77.34,46.22 U1.28
0;CS----/CTS/DIR1/IO--/LRCLK: length 2.9
  Top Layer w0.3: U1.35 59.56,49.2 R27.1
0;INT-/INT--/DIR2/IO: length 3
  Top Layer w0.3: 69.71,46.21 69.71,49.2 U1.31
0;MISO/RXD/S1A-/SCL/ADC-D: length 2.9
  Top Layer w0.3: U1.33 64.64,49.2 R29.1
0;MOSI-/TXD/EN1-/IO--/DAC-D: length 2.9
  Top Layer w0.3: R28.1 62.1,46.27 U1.34
0;RST/RST/EN1-/IO: length 3
  Top Layer w0.3: U1.30 72.26,46.22 72.25,46.21
1;CLK--/RTS/S1B-/SDA/BCLK--: length 3.4
  Top Layer w0.3: R38.1 41.91,72.06 41.91,72.06
1;CS2/IO---/S2A-/IO: length 3.4
  Top Layer w0.3: R41.2 62.23,72.06 62.23,72.06
1;CS3/IO---/S2B-/IO: length 3.4
  Top Layer w0.3: R42.2 74.93,72.06 74.93,72.06
1;CS----/CTS/DIR1/IO--/LRCLK: length 3.4
  Top Layer w0.3: 49.53,72.06 49.53,68.63 R35.1
1;INT-/INT--/DIR2/IO: length 3.4
  Top Layer w0.3: 52.07,72.06 52.07,72.06 R39.2
1;MISO/RXD/S1A-/SCL/ADC-D: length 3.4
  Top Layer w0.3: R37.1 44.45,68.63 44.45,72.06
1;MOSI/TXD/EN1-/IO--/DAC-D: length 3.4
  Top Layer w0.3: 46.99,72.06 46.99,72.06 R36.1
1;RST/RST/EN1-/IO: length 3.4
  Top Layer w0.3: R40.2 54.61,68.62 54.61,72.06
BUZZER: length 3.4
  Top Layer w0.3: 64.77,72.06 64.77,68.63 R16.1
D+: length 91.8
  Top Layer w0.15: 6.08,54.47 6.23,54.62 6.71,54.62 6.73,54.6 7.69,54.6 ; 6.08,54.47 5.94,54.32 5.94,53.85 6.23,53.55 6.69,53.55 6.74,53.6 7.69,53.6 ; 6.08,54.47 v1(5.7,54.85)
  Top Layer w0.25: U1.41 42.1,51.42 21.09,51.42 16.14,56.37 11.16,56.37 9.39,54.6 7.69,54.6 ; v1(3.54,68.18) 3.54,67.8 3.78,67.56 USB1.3 ; v1(5.57,76.19) 5.57,76.31 5.19,76.7 5.19,88.45 5.95,89.21 7.15,89.21 8.33,88.03 U3.3
  Bottom Layer w0.25: v1(5.7,54.85) 5.7,55.58 3.92,57.36 3.92,67.45 3.54,67.83 v1(3.54,68.18) 3.54,68.54 3.92,68.92 3.92,74.53 v1(5.57,76.19)
D-: length 86.6
  Top Layer w0.25: 7.69,55.1 6.72,55.1 v1(6.46,55.36) ; 12.68,90.63 6.83,90.63 4.81,88.61 4.81,75.42 v1(5.32,74.92) ; USB1.2 4.33,68.21 v1(4.3,68.18) ; v1(6.46,54.09) 7.67,54.09 7.69,54.1 9.43,54.1 11.31,55.99 15.99,55.99 20.94,51.04 33.89,51.04 33.9,51.04 39.94,51.04 U1.42
  Bottom Layer w0.25: v1(6.46,54.09) v1(6.46,55.36) 4.3,57.52 v1(4.3,68.18) 4.3,73.9 v1(5.32,74.92)
LED-B: length 39.1
  Bottom Layer w0.3: U1.39 49.4,39.87 36.56,27.04 36.56,19.59 LED-B.2
LED-G: length 72.1
  Bottom Layer w0.3: 77.47,72.06 77.47,65.66 74.03,62.22 65.26,62.22 53.2,50.15 53.2,40.63 49.53,36.96 LED-G.1
LED-R: length 41
  Bottom Layer w0.3: LED-R.2 65.77,16.62 54.48,27.91 U1.37
LED-Y: length 2.9
  Top Layer w0.3: R13.2 57.02,46.27 U1.36
POT0: length 3.1
  Top Layer w0.3: U1.26 82.42,46.15 82.42,46.14
POT1: length 2.9
  Top Layer w0.3: U1.27 79.88,46.27 R15.1
RGBLED-B: length 61.7
  Top Layer w0.3: v1(28.86,24.68) R7.1
  Bottom Layer w0.3: 57.15,72.06 57.14,72.05 57.14,65.77 43.04,51.67 43.04,47.86 28.86,33.69 v1(28.86,24.68)
RGBLED-G: length 62.2
  Top Layer w0.3: R6.1 v1(30.13,24.68)
  Bottom Layer w0.3: v1(30.13,24.68) 30.13,32.55 45.58,47.99 45.58,51.55 59.69,65.66 59.69,72.06
RGBLED-R: length 33
  Top Layer w0.3: v1(32.8,24.68) R5.1
  Bottom Layer w0.3: v1(32.8,24.68) 32.8,32.93 46.86,46.99 U1.40
SER0: length 3.4
  Top Layer w0.3: 72.39,72.06 72.39,72.06 R26.1
SER1: length 3.4
  Top Layer w0.3: 69.85,72.06 69.85,72.06 R25.1
SER2: length 3.4
  Top Layer w0.3: 67.31,68.61 67.31,68.62 67.31,72.06
SW0: length 3.4
  Top Layer w0.3: R18.1 82.55,68.63 82.55,72.06
SW1: length 3.4
  Top Layer w0.3: R19.1 80.01,72.06 80.01,72.06
SW2: length 2.9
  Top Layer w0.3: R20.1 51.94,49.2 U1.38
$1N8518: length 13.1
  Top Layer w1: 39.37,72.06 37.08,74.35 D1.2
$2N359: length 53.1
  Top Layer w0.3: 95.62,12.05 91.06,12.05 POT-0.2 ; 95.62,12.05 C7.2 ; 95.62,12.05 95.62,37.62 91.27,41.96 83.49,41.96 82.41,43.04 82.41,44.75 R14.2
$2N362: length 99.9
  Top Layer w0.3: 19.29,11.42 19.29,19.42 25.26,25.39 78.6,25.39 v1(78.85,25.13) ; 19.29,11.42 14.42,11.42 POT-1.2 ; 19.29,11.42 C8.2 ; R15.2 79.88,43.69 v1(78.85,42.66)
  Bottom Layer w0.3: v1(78.85,25.13) v1(78.85,42.66)
$2N10987: length 47.7
  Top Layer w0.3: 30.24,8.47 30.24,10.05 37.45,17.26 v1(37.45,21.45) ; 30.24,8.47 C6.2 ; 30.24,8.47 R12.1 ; v1(51.94,41.2) R20.2
  Bottom Layer w0.3: v1(37.45,21.45) 37.45,26.71 v1(51.94,41.2)
$2N10988: length 23.5
  Top Layer w0.3: SW5.4 35.04,11.01 35.04,9.64 35.93,8.75 35.93,4.77 ; R12.2 30.24,5.41 30.88,4.77 SW2.3 35.89,4.77 ; SW5.3 35.05,3.79 ; 35.93,4.77 35.93,4.18 35.55,3.8 34.15,3.8 33.57,3.21 R23.1 ; 35.93,4.77 SW2.4
$2N11241: length 84
  Top Layer w0.3: v1(79.99,63.74) 79.99,67.1 R19.2 ; 45.24,8.42 46.43,8.42 46.48,8.47 ; 45.24,8.42 45.24,10.35 48.42,13.53 62.8,13.53 68.44,19.16 v1(68.44,21.58) ; 45.24,8.42 R11.1
  Bottom Layer w0.3: v1(79.99,63.74) 68.44,52.18 v1(68.44,21.58)
$2N11242: length 23.6
  Top Layer w0.3: 50.05,3.8 49.13,3.8 48.55,3.21 R22.1 ; 50.05,3.8 SW4.3 ; 50.05,3.8 50.53,3.8 50.91,4.18 50.91,4.77 ; 50.91,4.77 50.91,8.75 50.05,9.61 SW4.4 ; 50.91,4.77 SW1.4 ; 50.91,4.77 SW1.3 49.27,4.74 45.88,4.74 45.24,5.37 R11.2
$2N11304: length 70.5
  Top Layer w0.3: R18.2 82.54,67.1 v1(82.54,63.74) ; 61.34,8.47 61.29,8.42 60.11,8.42 ; R10.1 60.11,8.42 ; 60.11,8.42 60.11,10.19 69.2,19.29 v1(69.2,21.58)
  Bottom Layer w0.3: v1(69.2,21.58) 69.2,45.83 70.85,47.48 70.85,52.06 v1(82.54,63.74)
$2N11305: length 23.7
  Top Layer w0.3: 65.91,4.77 SW0.3 64.27,4.74 60.74,4.74 60.11,5.37 R10.2 ; 65.91,4.77 SW0.4 ; 65.91,4.77 65.91,8.74 65.05,9.6 SW3.4 ; 65.91,4.77 65.9,4.76 65.9,4.18 65.52,3.79 65.05,3.79 SW3.3 ; 65.05,3.8 64.12,3.8 63.54,3.21 R21.1
$2N12771: length 24
  Top Layer w0.3: Q1.1 v1(62.45,24.41) 62.43,24.39 ; R13.1 v1(57.02,41.2)
  Bottom Layer w0.3: v1(57.02,41.2) 57.02,29.82 62.43,24.41 v1(62.45,24.41)
$2N13946: length 4.6
  Top Layer w0.3: LED-RGB.1 32.75,21.15 R5.2
$2N14144: length 4.6
  Top Layer w0.3: R6.2 30.13,16.64 LED-RGB.3
$2N14210: length 4.6
  Top Layer w0.3: LED-RGB.4 28.85,21.18 R7.2
$2N39552: length 4.6
  Top Layer w0.3: R1.1 LED-R.1
$2N39556: length 4.6
  Top Layer w0.3: R2.1 LED-G.2
$2N39560: length 4.6
  Top Layer w0.3: R3.1 LED-B.1
$2N39724: length 4.6
  Top Layer w0.3: LED-Y.1 62.09,16.65 R4.1
$2N45506: length 58.8
  Top Layer w0.3: v1(39.24,58.6) 57.71,58.6 64.77,65.66 R16.2 ; Q2.1 v1(22.77,39.1)
  Bottom Layer w0.3: v1(39.24,58.6) 36.82,56.17 36.82,54.89 22.77,40.84 v1(22.77,39.1)
$2N45675: length 9.4
  Top Layer w0.3: R17.1 23.72,35.29 ; 23.72,35.29 BUZZER2.1 ; 23.72,35.29 Q2.3
$2N47090: length 4.7
  Top Layer w0.3: 62.09,22.08 62.12,22.11 62.12,22.83 62.76,23.46 Q1.3
$3N11553: length 24.6
  Top Layer w0.3: DIGILENT0.1 87.37,39.81 70.39,39.81 67.17,43.04 67.17,44.75 R30.2
$3N12840: length 24.6
  Top Layer w0.3: R31.1 69.71,44.71 69.71,44.7 69.71,43.04 72.5,40.24 89.48,40.24 DIGILENT0.2
$3N12844: length 26.6
  Top Layer w0.3: DIGILENT0.4 92.19,37.63 92.19,39.23 90.74,40.67 74.61,40.67 72.25,43.03 72.25,44.71
$3N12848: length 27.4
  Top Layer w0.3: 74.79,44.71 74.79,44.7 74.79,43.04 76.73,41.1 90.92,41.1 92.61,39.41 92.61,35.52 DIGILENT0.6
$3N12852: length 28.1
  Top Layer w0.3: 77.33,44.71 77.33,44.7 77.33,43.04 78.84,41.53 91.1,41.53 93.04,39.58 93.04,33.41 DIGILENT0.8
$3N13146: length 56.4
  Top Layer w0.3: R37.2 44.45,65.71 42.67,63.93 v1(39.24,63.93)
  Bottom Layer w0.3: v1(39.24,63.93) 16.95,41.64 8.62,41.64 7.35,40.37 7.35,35.73 DIGILENT1.5
$3N13154: length 52.7
  Top Layer w0.3: R35.2 49.53,65.71 45.97,62.15 v1(39.24,62.15)
  Bottom Layer w0.3: v1(39.24,62.15) 17.46,40.37 10.86,40.37 DIGILENT1.1
$3N13372: length 52.7
  Top Layer w0.3: 52.07,67.12 52.07,65.71 47.62,61.27 v1(39.24,61.27)
  Bottom Layer w0.3: DIGILENT1.2 12.76,39.74 17.71,39.74 v1(39.24,61.27)
$3N13376: length 56.4
  Top Layer w0.3: v1(39.24,60.38) 49.28,60.38 54.61,65.71 R40.1
  Bottom Layer w0.3: v1(39.24,60.38) 39.24,60.34 18.01,39.1 14.67,39.1 DIGILENT1.4
$3N13380: length 65
  Top Layer w0.3: v1(39.24,59.49) 56.01,59.49 62.23,65.71 62.23,67.12
  Bottom Layer w0.3: v1(39.24,59.49) 18.22,38.47 16.57,38.47 DIGILENT1.6
$3N13384: length 78.8
  Top Layer w0.3: v1(36.05,54.98) 36.12,55.04 64.26,55.04 74.93,65.71 R42.1
  Bottom Layer w0.3: DIGILENT1.8 11.87,31.22 35.63,54.98 v1(36.05,54.98)
$3N20834: length 28.2
  Top Layer w0.3: DIGILENT0.3 85.26,39.39 68.28,39.39 64.64,43.02 R29.2
$3N20855: length 31.8
  Top Layer w0.3: R28.2 62.09,44.75 62.09,43.04 66.17,38.96 83.15,38.96 DIGILENT0.5
$3N20876: length 35.4
  Top Layer w0.3: R27.2 59.56,43.02 64.06,38.53 81.04,38.53 DIGILENT0.7
$3N20951: length 64.6
  Top Layer w0.3: S0.1 26.64,68.07 36.94,57.77 59.37,57.77 67.31,65.71 R24.2
$3N20972: length 64
  Top Layer w0.3: S1.1 34.84,58.6 36.62,56.82 60.96,56.82 69.85,65.71 R25.2
$3N20993: length 69
  Top Layer w0.3: R26.2 72.39,65.71 62.61,55.93 27.48,55.93 v1(27.42,55.87)
  Bottom Layer w0.3: S2.1 20.68,49.12 v1(27.42,55.87)
$3N21087: length 55.5
  Top Layer w0.3: R36.2 46.99,65.71 44.32,63.04 v1(39.24,63.04)
  Bottom Layer w0.3: DIGILENT1.3 9.14,36.3 7.99,37.45 7.99,40.12 8.88,41.01 17.21,41.01 v1(39.24,63.04)
$3N21108: length 57.5
  Top Layer w0.3: R38.2 41.91,65.71 41.02,64.82 v1(39.24,64.82)
  Bottom Layer w0.3: DIGILENT1.7 6.72,33.82 6.72,40.63 8.37,42.28 16.7,42.28 v1(39.24,64.82)
$3N35555: length 6.4
  Top Layer w0.3: 7.69,52.6 9.21,52.6 v1(9.26,52.56) ; R43.1 v1(9.26,48.63)
  Bottom Layer w0.3: v1(9.26,52.56) v1(9.26,48.63)
$3N35574: length 10.1
  Top Layer w0.3: 7.69,55.6 7.69,55.61 v1(9.26,55.61) ; R51.2 v1(7.61,48.63)
  Bottom Layer w0.3: v1(9.26,55.61) 8.62,54.98 8.62,49.64 v1(7.61,48.63)

## Copper pours and planes (outline as drawn; the poured copper is in the pictures)
+5V on Top Layer: 8.84,101.37 8.84,90.95 8.64,90.75 7.24,90.75 5.22,88.73 5.19,73.01 9.76,70.09 9.75,24.47 6.92,21.64 -7.95,21.64 -13.48,27.16 -13.48,106.67 7.61,106.67 8.88,105.4 8.88,101.4
GND on Top Layer: -2.36,101.97 100.89,101.97 100.89,-1.16 -2.36,-1.16
GND on Bottom Layer: -3.7,102.73 102.98,102.73 102.98,-3.82 -3.7,-3.82

## Text on the board
Top Silkscreen Layer: Z | GPIO14 | GPIO12 | GPIO13 | GPIO11 | GND | 5V | GPIO7 | GPIO9 | GPIO8 | GPIO10 | GPIO35 | GPIO37 | GPIO36 | GPIO38 | GPIO42 | GPIO40 | GPIO41 | GPIO39 | POWERBANK INPUT | SERVO OUTPUTS
